# EAGLE schematic rt1060r1 (EAGLE 9.6.2)
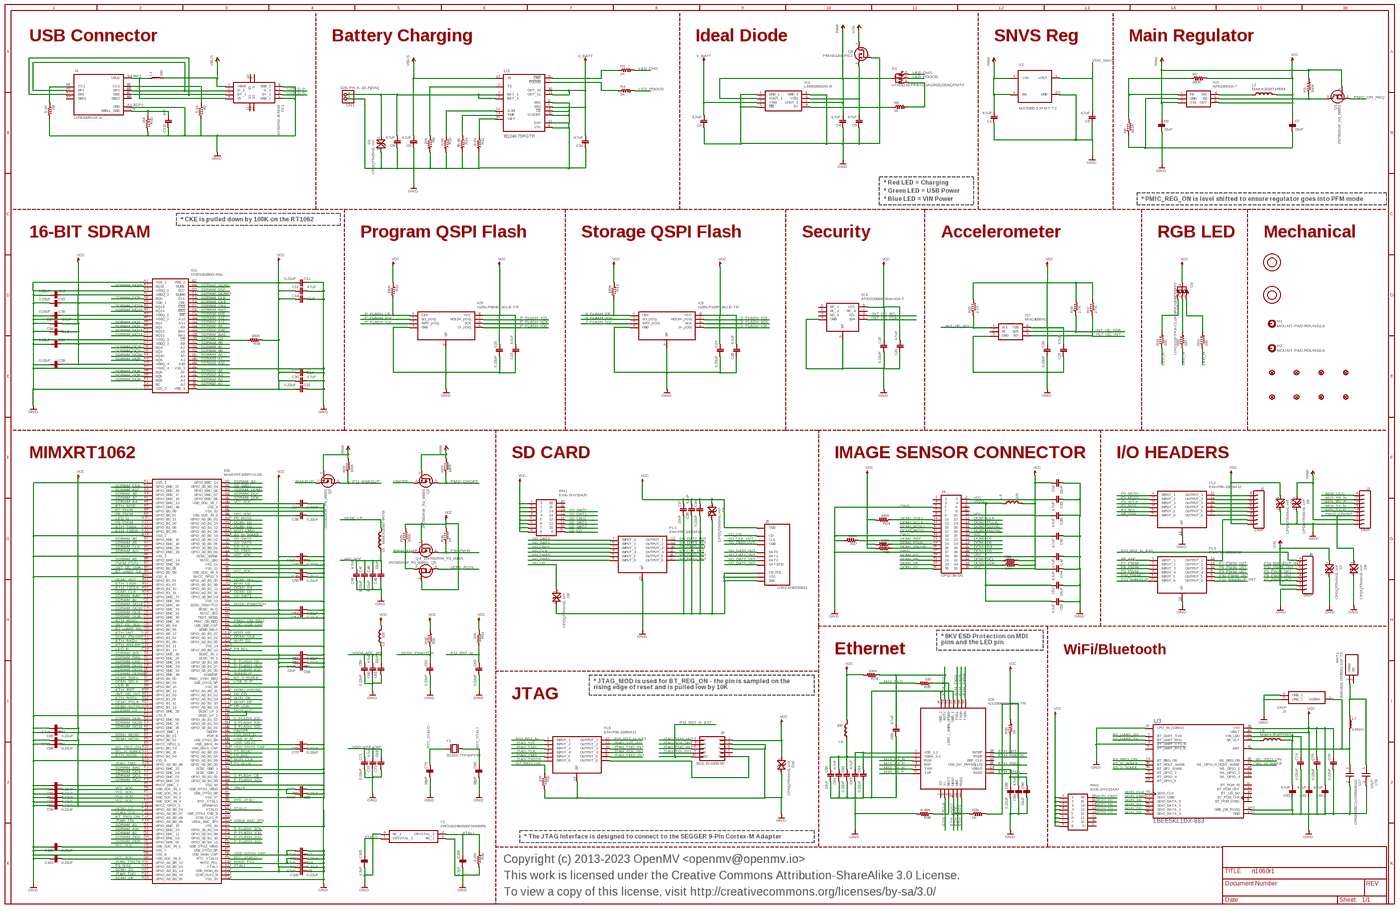
[diagram p0: schematic, sheet 1, overview]
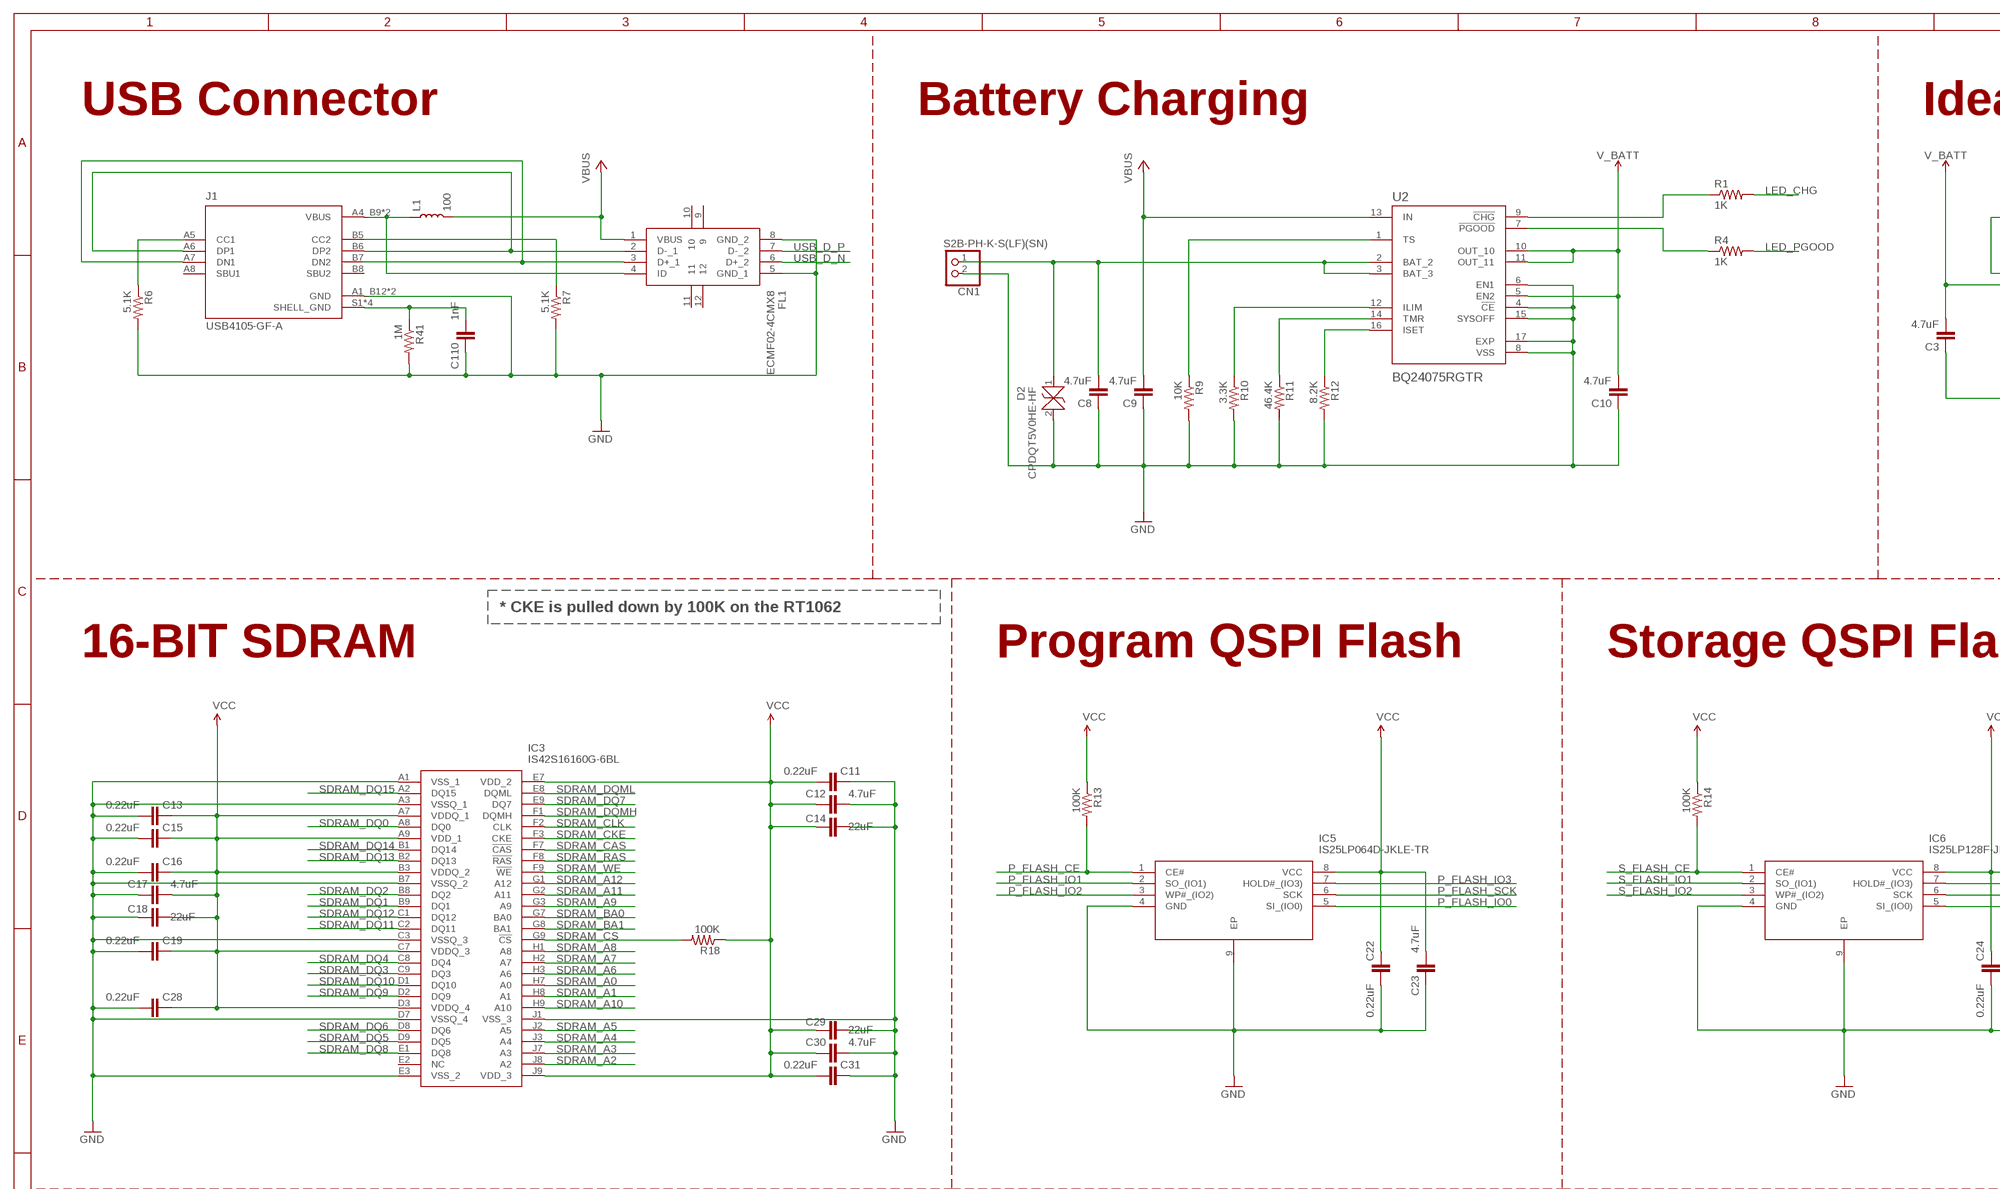
[diagram p1: schematic, sheet 1, part 1 of 4]
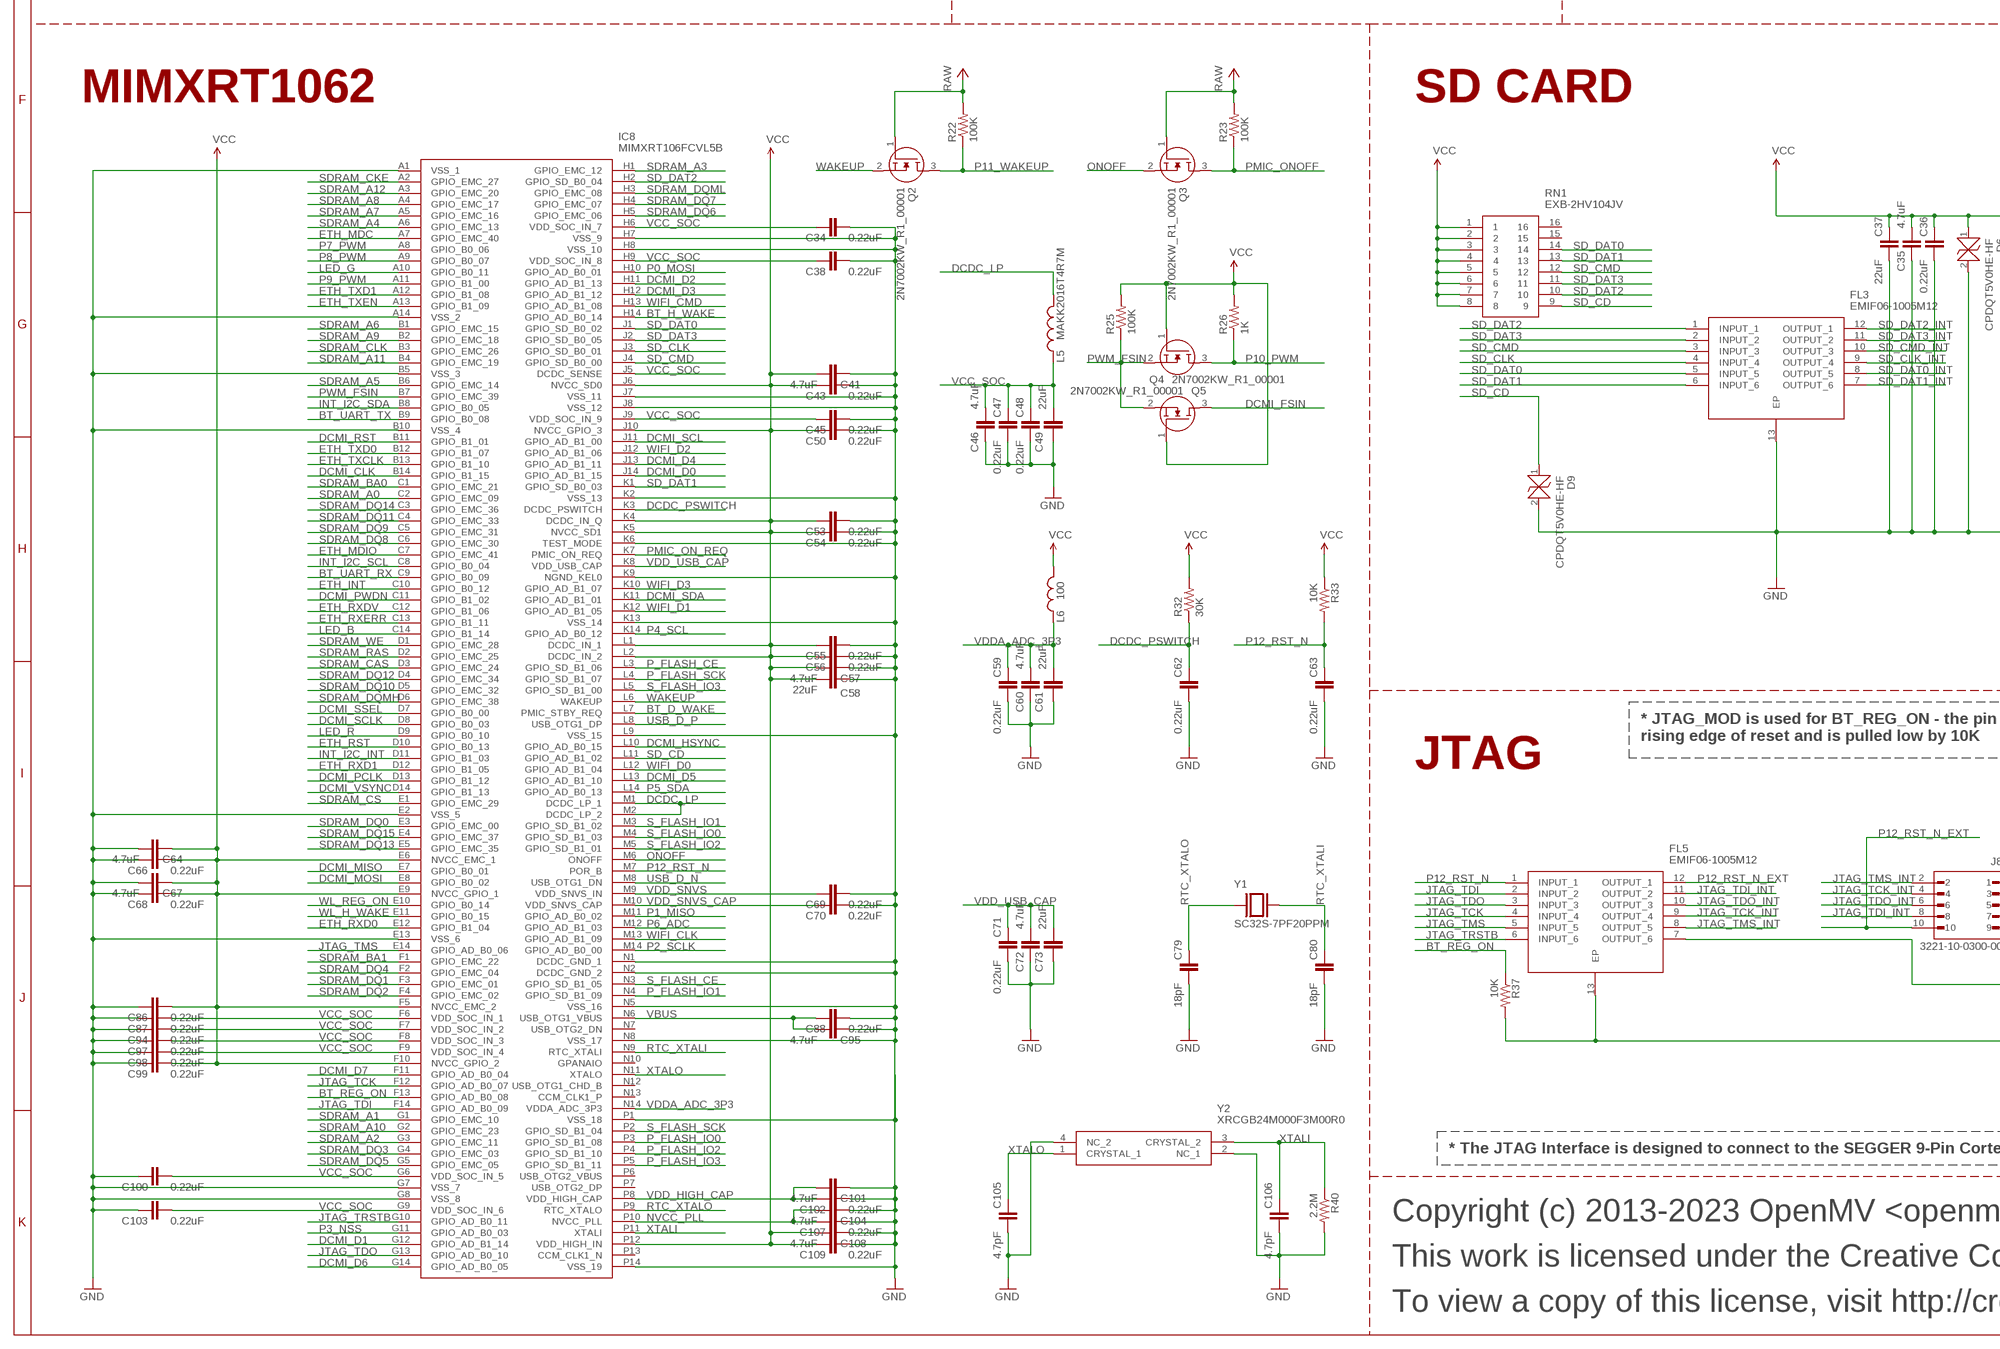
[diagram p2: schematic, sheet 1, part 2 of 4]
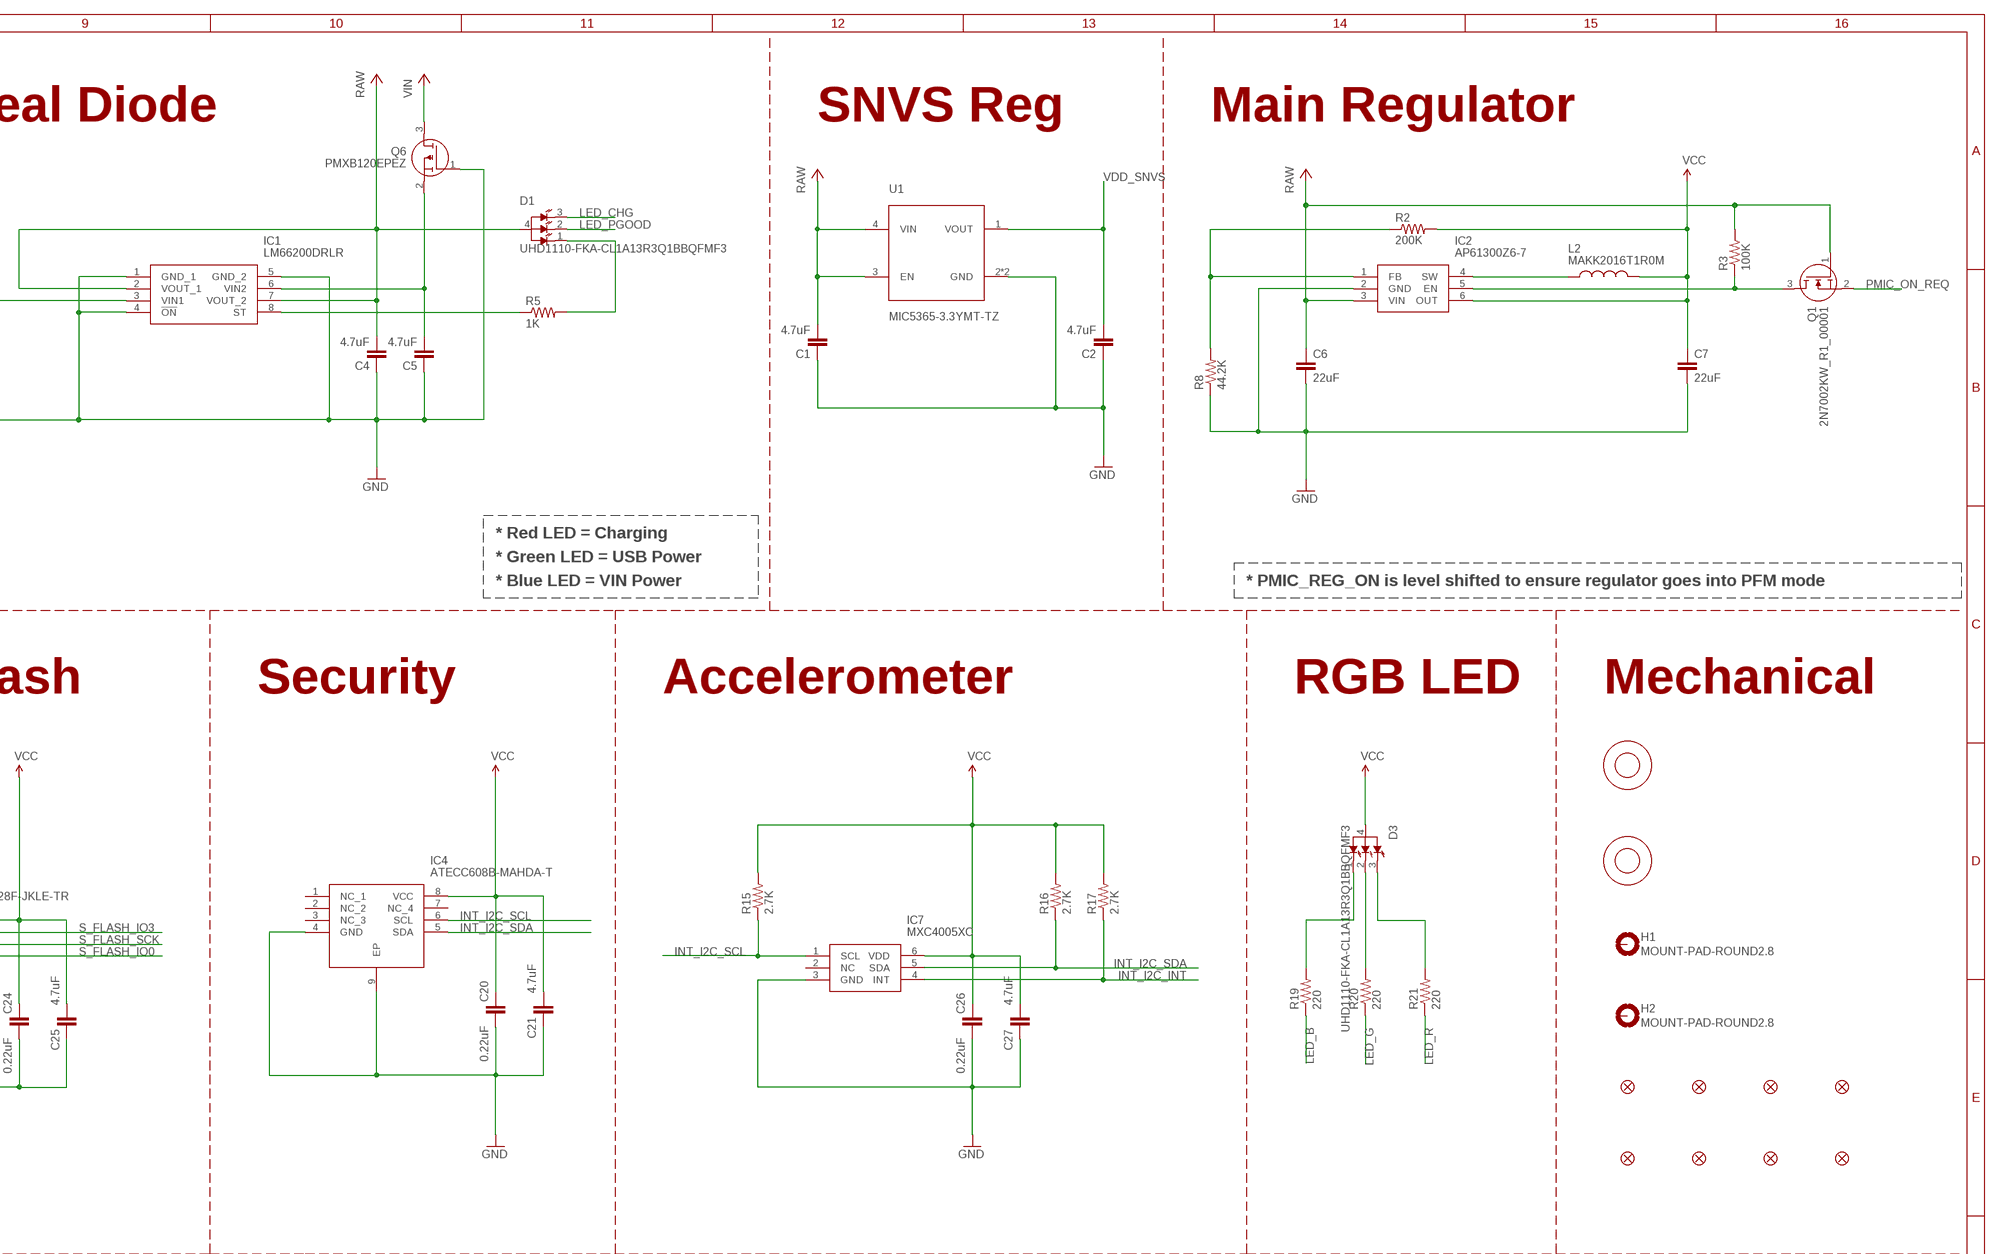
[diagram p3: schematic, sheet 1, part 3 of 4]
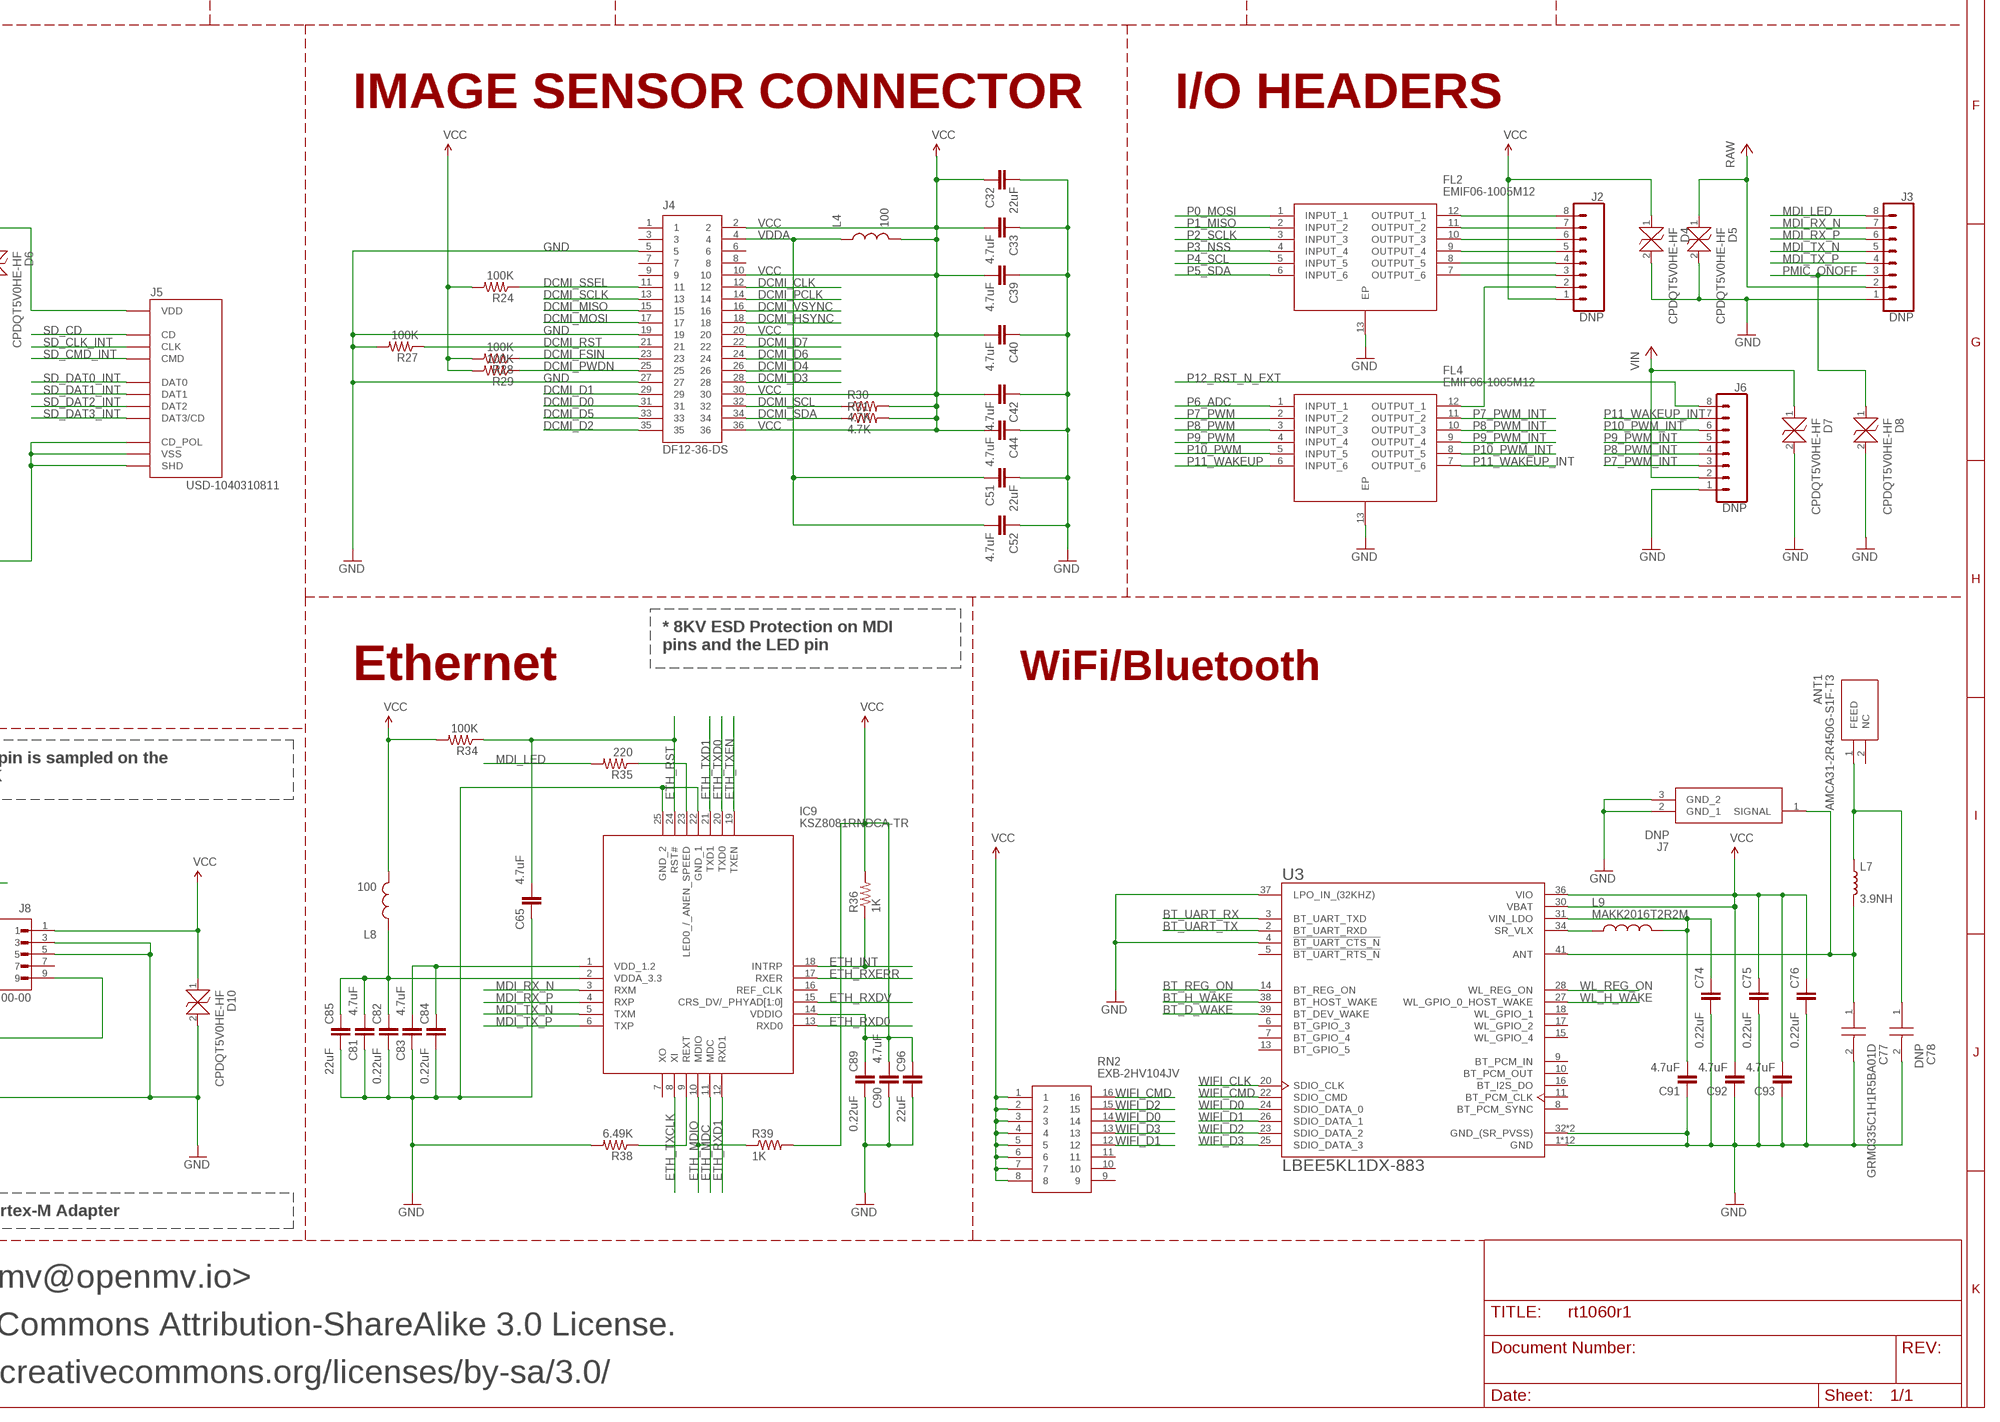
[diagram p4: schematic, sheet 1, part 4 of 4]

## Parts
ANT1  AMCA31-2R450G-S1F-T3  [ANTC3216X140N]
C1  4.7uF  CAP0402-CAP  [0402-CAP]
C2  4.7uF  CAP0402-CAP  [0402-CAP]
C3  4.7uF  CAP0402-CAP  [0402-CAP]
C4  4.7uF  CAP0402-CAP  [0402-CAP]
C5  4.7uF  CAP0402-CAP  [0402-CAP]
C6  22uF  22UF-0805-6.3V-20%  [0805]
C7  22uF  22UF-0805-6.3V-20%  [0805]
C8  4.7uF  CAP0402-CAP  [0402-CAP]
C9  4.7uF  CAP0402-CAP  [0402-CAP]
C10  4.7uF  CAP0402-CAP  [0402-CAP]
C11  0.22uF  C-EUC0201  [C0201]
C12  4.7uF  CAP0402-CAP  [0402-CAP]
C13  0.22uF  C-EUC0201  [C0201]
C14  22uF  22UF-0805-6.3V-20%  [0805]
C15  0.22uF  C-EUC0201  [C0201]
C16  0.22uF  C-EUC0201  [C0201]
C17  4.7uF  CAP0402-CAP  [0402-CAP]
C18  22uF  22UF-0805-6.3V-20%  [0805]
C19  0.22uF  C-EUC0201  [C0201]
C20  0.22uF  C-EUC0201  [C0201]
C21  4.7uF  CAP0402-CAP  [0402-CAP]
C22  0.22uF  C-EUC0201  [C0201]
C23  4.7uF  CAP0402-CAP  [0402-CAP]
C24  0.22uF  C-EUC0201  [C0201]
C25  4.7uF  CAP0402-CAP  [0402-CAP]
C26  0.22uF  C-EUC0201  [C0201]
C27  4.7uF  CAP0402-CAP  [0402-CAP]
C28  0.22uF  C-EUC0201  [C0201]
C29  22uF  22UF-0805-6.3V-20%  [0805]
C30  4.7uF  CAP0402-CAP  [0402-CAP]
C31  0.22uF  C-EUC0201  [C0201]
C32  22uF  22UF-0805-6.3V-20%  [0805]
C33  4.7uF  CAP0402-CAP  [0402-CAP]
C34  0.22uF  C-EUC0201  [C0201]
C35  4.7uF  CAP0402-CAP  [0402-CAP]
C36  0.22uF  C-EUC0201  [C0201]
C37  22uF  22UF-0805-6.3V-20%  [0805]
C38  0.22uF  C-EUC0201  [C0201]
C39  4.7uF  CAP0402-CAP  [0402-CAP]
C40  4.7uF  CAP0402-CAP  [0402-CAP]
C41  4.7uF  CAP0402-CAP  [0402-CAP]
C42  4.7uF  CAP0402-CAP  [0402-CAP]
C43  0.22uF  C-EUC0201  [C0201]
C44  4.7uF  CAP0402-CAP  [0402-CAP]
C45  0.22uF  C-EUC0201  [C0201]
C46  4.7uF  CAP0402-CAP  [0402-CAP]
C47  0.22uF  C-EUC0201  [C0201]
C48  0.22uF  C-EUC0201  [C0201]
C49  22uF  22UF-0805-6.3V-20%  [0805]
C50  0.22uF  C-EUC0201  [C0201]
C51  22uF  22UF-0805-6.3V-20%  [0805]
C52  4.7uF  CAP0402-CAP  [0402-CAP]
C53  0.22uF  C-EUC0201  [C0201]
C54  0.22uF  C-EUC0201  [C0201]
C55  0.22uF  C-EUC0201  [C0201]
C56  0.22uF  C-EUC0201  [C0201]
C57  4.7uF  CAP0402-CAP  [0402-CAP]
C58  22uF  22UF-0805-6.3V-20%  [0805]
C59  0.22uF  C-EUC0201  [C0201]
C60  4.7uF  CAP0402-CAP  [0402-CAP]
C61  22uF  22UF-0805-6.3V-20%  [0805]
C62  0.22uF  C-EUC0201  [C0201]
C63  0.22uF  C-EUC0201  [C0201]
C64  4.7uF  CAP0402-CAP  [0402-CAP]
C65  4.7uF  CAP0402-CAP  [0402-CAP]
C66  0.22uF  C-EUC0201  [C0201]
C67  4.7uF  CAP0402-CAP  [0402-CAP]
C68  0.22uF  C-EUC0201  [C0201]
C69  0.22uF  C-EUC0201  [C0201]
C70  0.22uF  C-EUC0201  [C0201]
C71  0.22uF  C-EUC0201  [C0201]
C72  4.7uF  CAP0402-CAP  [0402-CAP]
C73  22uF  22UF-0805-6.3V-20%  [0805]
C74  0.22uF  C-EUC0201  [C0201]
C75  0.22uF  C-EUC0201  [C0201]
C76  0.22uF  C-EUC0201  [C0201]
C77  GRM0335C1H1R5BA01D  [CAPC0603X33N]
C78  DNP  GRM0335C1H1R5BA01D  [CAPC0603X33N]
C79  18pF  C-EUC0201  [C0201]
C80  18pF  C-EUC0201  [C0201]
C81  4.7uF  CAP0402-CAP  [0402-CAP]
C82  0.22uF  C-EUC0201  [C0201]
C83  4.7uF  CAP0402-CAP  [0402-CAP]
C84  0.22uF  C-EUC0201  [C0201]
C85  22uF  22UF-0805-6.3V-20%  [0805]
C86  0.22uF  C-EUC0201  [C0201]
C87  0.22uF  C-EUC0201  [C0201]
C88  0.22uF  C-EUC0201  [C0201]
C89  0.22uF  C-EUC0201  [C0201]
C90  4.7uF  CAP0402-CAP  [0402-CAP]
C91  4.7uF  CAP0402-CAP  [0402-CAP]
C92  4.7uF  CAP0402-CAP  [0402-CAP]
C93  4.7uF  CAP0402-CAP  [0402-CAP]
C94  0.22uF  C-EUC0201  [C0201]
C95  4.7uF  CAP0402-CAP  [0402-CAP]
C96  22uF  22UF-0805-6.3V-20%  [0805]
C97  0.22uF  C-EUC0201  [C0201]
C98  0.22uF  C-EUC0201  [C0201]
C99  0.22uF  C-EUC0201  [C0201]
C100  0.22uF  C-EUC0201  [C0201]
C101  4.7uF  CAP0402-CAP  [0402-CAP]
C102  0.22uF  C-EUC0201  [C0201]
C103  0.22uF  C-EUC0201  [C0201]
C104  4.7uF  CAP0402-CAP  [0402-CAP]
C105  4.7pF  C-EUC0201  [C0201]
C106  4.7pF  C-EUC0201  [C0201]
C107  0.22uF  C-EUC0201  [C0201]
C108  4.7uF  CAP0402-CAP  [0402-CAP]
C109  0.22uF  C-EUC0201  [C0201]
C110  1nF  CAP0402-CAP  [0402-CAP]
CN1  S2B-PH-K-S(LF)(SN)  JST_2PIN-THM-RA  [JST-PH-2-THM-RA]
D1  UHD1110-FKA-CL1A13R3Q1BBQFMF3  [LED_UHD1110-FKA-CL1A13R3Q1BBQFMF3]
D2  CPDQT5V0HE-HF  [CPDQT5V0HEHF]
D3  UHD1110-FKA-CL1A13R3Q1BBQFMF3  [LED_UHD1110-FKA-CL1A13R3Q1BBQFMF3]
D4  CPDQT5V0HE-HF  [CPDQT5V0HEHF]
D5  CPDQT5V0HE-HF  [CPDQT5V0HEHF]
D6  CPDQT5V0HE-HF  [CPDQT5V0HEHF]
D7  CPDQT5V0HE-HF  [CPDQT5V0HEHF]
D8  CPDQT5V0HE-HF  [CPDQT5V0HEHF]
D9  CPDQT5V0HE-HF  [CPDQT5V0HEHF]
D10  CPDQT5V0HE-HF  [CPDQT5V0HEHF]
FD1  FIDUCIAL1X2  [FIDUCIAL-1X2]
FD2  FIDUCIAL1X2  [FIDUCIAL-1X2]
FD3  FIDUCIAL1X2  [FIDUCIAL-1X2]
FD4  FIDUCIAL1X2  [FIDUCIAL-1X2]
FD5  FIDUCIAL1X2  [FIDUCIAL-1X2]
FD6  FIDUCIAL1X2  [FIDUCIAL-1X2]
FD7  FIDUCIAL1X2  [FIDUCIAL-1X2]
FD8  FIDUCIAL1X2  [FIDUCIAL-1X2]
FL1  ECMF02-4CMX8  [ECMF024CMX8]
FL2  EMIF06-1005M12  [SON40P150X250X65-13N]
FL3  EMIF06-1005M12  [SON40P150X250X65-13N]
FL4  EMIF06-1005M12  [SON40P150X250X65-13N]
FL5  EMIF06-1005M12  [SON40P150X250X65-13N]
H1  MOUNT-PAD-ROUND2.8  [2,8-PAD]
H2  MOUNT-PAD-ROUND2.8  [2,8-PAD]
IC1  LM66200DRLR  [SOTFL50P160X60-8N]
IC2  AP61300Z6-7  [SOTFL50P162X60-6N]
IC3  IS42S16160G-6BL  [BGA54C80P9X9_800X800X120]
IC4  ATECC608B-MAHDA-T  [SON50P300X200X60-9N]
IC5  IS25LP064D-JKLE-TR  [SON127P500X595X80-9N]
IC6  IS25LP128F-JKLE-TR  [SON127P500X595X80-9N]
IC7  MXC4005XC  [MXC4005XC]
IC8  MIMXRT106FCVL5B  MIMXRT1052DVL6B  [BGA196C65P14X14_1000X1000X143]
IC9  KSZ8081RNDCA-TR  [QFN50P400X400X90-25N]
J1  USB4105-GF-A  [GCT_USB4105-GF-A]
J2  DNP  CONN_08"  [1X08]
J3  DNP  CONN_08"  [1X08]
J4  DF12-36-DS  [DF12-36-DS]
J5  USD-1040310811  [1040310811]
J6  DNP  CONN_08"  [1X08]
J7  DNP  2337019-1  [23370191]
J8  3221-10-0300-00  [CNC_3221-10-0300-00]
L1  100  INDUCTOR-0603-33NH  [0603]
L2  MAKK2016T1R0M  [INDC2016X100N]
L4  100  INDUCTOR0402  [C0402]
L5  MAKK2016T4R7M  [INDC2016X100N]
L6  100  INDUCTOR0402  [C0402]
L7  3.9NH  INDUCTOR-0402-3.9NH  [0402]
L8  100  INDUCTOR0402  [C0402]
L9  MAKK2016T2R2M  [INDC2016X100N]
M1  9774030151R  [9774030151R]
M2  9774030151R  [9774030151R]
Q1  2N7002KW_R1_00001  [SOT65P210X110-3N]
Q2  2N7002KW_R1_00001  [SOT65P210X110-3N]
Q3  2N7002KW_R1_00001  [SOT65P210X110-3N]
Q4  2N7002KW_R1_00001  [SOT65P210X110-3N]
Q5  2N7002KW_R1_00001  [SOT65P210X110-3N]
Q6  PMXB120EPEZ  [PMXB120EPEZ]
R1  1K  RESISTOR0402-RES  [0402-RES]
R2  200K  RESISTOR0402-RES  [0402-RES]
R3  100K  RESISTOR0402-RES  [0402-RES]
R4  1K  RESISTOR0402-RES  [0402-RES]
R5  1K  RESISTOR0402-RES  [0402-RES]
R6  5.1K  RESISTOR0402-RES  [0402-RES]
R7  5.1K  RESISTOR0402-RES  [0402-RES]
R8  44.2K  RESISTOR0402-RES  [0402-RES]
R9  10K  RESISTOR0402-RES  [0402-RES]
R10  3.3K  RESISTOR0402-RES  [0402-RES]
R11  46.4K  RESISTOR0402-RES  [0402-RES]
R12  8.2K  RESISTOR0402-RES  [0402-RES]
R13  100K  RESISTOR0402-RES  [0402-RES]
R14  100K  RESISTOR0402-RES  [0402-RES]
R15  2.7K  RESISTOR0402-RES  [0402-RES]
R16  2.7K  RESISTOR0402-RES  [0402-RES]
R17  2.7K  RESISTOR0402-RES  [0402-RES]
R18  100K  RESISTOR0402-RES  [0402-RES]
R19  220  RESISTOR0402-RES  [0402-RES]
R20  220  RESISTOR0402-RES  [0402-RES]
R21  220  RESISTOR0402-RES  [0402-RES]
R22  100K  RESISTOR0402-RES  [0402-RES]
R23  100K  RESISTOR0402-RES  [0402-RES]
R24  100K  RESISTOR0402-RES  [0402-RES]
R25  100K  RESISTOR0402-RES  [0402-RES]
R26  1K  RESISTOR0402-RES  [0402-RES]
R27  100K  RESISTOR0402-RES  [0402-RES]
R28  100K  RESISTOR0402-RES  [0402-RES]
R29  100K  RESISTOR0402-RES  [0402-RES]
R30  4.7K  RESISTOR0402-RES  [0402-RES]
R31  4.7K  RESISTOR0402-RES  [0402-RES]
R32  30K  RESISTOR0402-RES  [0402-RES]
R33  10K  RESISTOR0402-RES  [0402-RES]
R34  100K  RESISTOR0402-RES  [0402-RES]
R35  220  RESISTOR0402-RES  [0402-RES]
R36  1K  RESISTOR0402-RES  [0402-RES]
R37  10K  RESISTOR0402-RES  [0402-RES]
R38  6.49K  RESISTOR0402-RES  [0402-RES]
R39  1K  RESISTOR0402-RES  [0402-RES]
R40  2.2M  RESISTOR0402-RES  [0402-RES]
R41  1M  RESISTOR0402-RES  [0402-RES]
RN1  EXB-2HV104JV  [EXB2HV104JV]
RN2  EXB-2HV104JV  [EXB2HV104JV]
U1  MIC5365-3.3YMT-TZ  [VREG_MIC5365-3.3YMT-TZ]
U2  BQ24075RGTR  [QFN50P300X300X100-17N]
U3  LBEE5KL1DX-883  LBEE5KL1DX-TEMP  [XCVR_LBEE5KL1DX-TEMP]
Y1  SC32S-7PF20PPM  ABS07-32.768KHZ-7-T  [XTAL_ABS07-32.768KHZ-7-T]
Y2  XRCGB24M000F3M00R0  [XRCGB24M000F3M00R0]

## Nets
ANT: C77.1 J7.1(SIGNAL) L7.2 U3.41(ANT)
BAT [power]: C8.2 CN1.1 D2.1 U2.2(BAT_2) U2.3(BAT_3)
BT_D_WAKE: IC8.L7(PMIC_STBY_REQ) U3.39(BT_DEV_WAKE)
BT_H_WAKE: IC8.H14(GPIO_AD_B0_14) U3.38(BT_HOST_WAKE)
BT_REG_ON: IC8.F13(GPIO_AD_B0_08) R37.1 U3.14(BT_REG_ON)
BT_UART_RX: IC8.C9(GPIO_B0_09) U3.3(BT_UART_TXD)
BT_UART_TX: IC8.B9(GPIO_B0_08) U3.2(BT_UART_RXD)
CC1: J1.A5(CC1) R6.1
CC2: J1.B5(CC2) R7.1
CHG: R1.1 U2.9(!CHG)
D_N [usb]: FL1.3(D+_1) J1.A7(DN1) J1.B7(DN2)
D_P [usb]: FL1.2(D-_1) J1.A6(DP1) J1.B6(DP2)
DCDC_LP: IC8.M1(DCDC_LP_1) IC8.M2(DCDC_LP_2) L5.2
DCDC_PSWITCH: C62.1 IC8.K3(DCDC_PSWITCH) R32.1
DCMI_CLK: IC8.B14(GPIO_B1_15) J4.12
DCMI_D0 [dcmi]: IC8.J14(GPIO_AD_B1_15) J4.31
DCMI_D1 [dcmi]: IC8.G12(GPIO_AD_B1_14) J4.29
DCMI_D2 [dcmi]: IC8.H11(GPIO_AD_B1_13) J4.35
DCMI_D3 [dcmi]: IC8.H12(GPIO_AD_B1_12) J4.28
DCMI_D4 [dcmi]: IC8.J13(GPIO_AD_B1_11) J4.26
DCMI_D5 [dcmi]: IC8.L13(GPIO_AD_B1_10) J4.33
DCMI_D6 [dcmi]: IC8.G14(GPIO_AD_B0_05) J4.24
DCMI_D7 [dcmi]: IC8.F11(GPIO_AD_B0_04) J4.22
DCMI_FSIN: J4.23 Q5.3(D) R28.1
DCMI_HSYNC [dcmi]: IC8.L10(GPIO_AD_B0_15) J4.18
DCMI_MISO [spi]: IC8.E7(GPIO_B0_01) J4.15
DCMI_MOSI [spi]: IC8.E8(GPIO_B0_02) J4.17
DCMI_PCLK [dcmi]: IC8.D13(GPIO_B1_12) J4.14
DCMI_PWDN: IC8.C11(GPIO_B1_02) J4.25 R29.1
DCMI_RST: IC8.B11(GPIO_B1_01) J4.21 R27.1
DCMI_SCL [i2c]: IC8.J11(GPIO_AD_B1_00) J4.32 R30.1
DCMI_SCLK [spi]: IC8.D8(GPIO_B0_03) J4.13
DCMI_SDA [i2c]: IC8.K11(GPIO_AD_B1_01) J4.34 R31.1
DCMI_SSEL [spi]: IC8.D7(GPIO_B0_00) J4.11 R24.1
DCMI_VSYNC [dcmi]: IC8.D14(GPIO_B1_13) J4.16
EN: IC2.5(EN) Q1.3(D) R3.1
ETH_INT: IC8.C10(GPIO_B0_12) IC9.18(INTRP) R36.1
ETH_LED: IC9.23(LED0_/_ANEN_SPEED) R35.1
ETH_MDC [mdio]: IC8.A7(GPIO_EMC_40) IC9.11(MDC)
ETH_MDIO [mdio]: IC8.C7(GPIO_EMC_41) IC9.10(MDIO) R39.1
ETH_RST: C65.2 IC8.D10(GPIO_B0_13) IC9.24(RST#) R34.1
ETH_RXD0 [eth]: IC8.E12(GPIO_B1_04) IC9.13(RXD0)
ETH_RXD1 [eth]: IC8.D12(GPIO_B1_05) IC9.12(RXD1)
ETH_RXDV [eth]: IC8.C12(GPIO_B1_06) IC9.15(CRS_DV/_PHYAD[1:0])
ETH_RXERR [eth]: IC8.C13(GPIO_B1_11) IC9.17(RXER)
ETH_TXCLK [eth]: IC8.B13(GPIO_B1_10) IC9.8(XI)
ETH_TXD0 [eth]: IC8.B12(GPIO_B1_07) IC9.20(TXD0)
ETH_TXD1 [eth]: IC8.A12(GPIO_B1_08) IC9.21(TXD1)
ETH_TXEN [eth]: IC8.A13(GPIO_B1_09) IC9.19(TXEN)
ETH_VDD_1.2: C83.2 C84.1 IC9.1(VDD_1.2)
ETH_VDDA_3.3: C81.2 C82.1 C85.1 IC9.2(VDDA_3.3) L8.1
FB [power]: IC2.1(FB) R2.1 R8.2
FEED: ANT1.1(FEED) C78.1 L7.1
GND [gnd]: C1.1 C2.1 C3.1 C4.1 C5.1 C6.2 C7.2 C8.1 C9.1 C10.1 C11.1 C12.2 C13.2 C14.2 C15.2 C16.2 C17.1 C18.1 C19.2 C20.2 C21.1 C22.2 C23.1 C24.2 C25.1 C26.2 C27.1 C28.2 C29.2 C30.2 C31.1 C32.2 C33.1 C34.2 C35.1 C36.2 C37.2 C38.2 C39.1 C40.1 C41.1 C42.1 C43.2 C44.1 C45.2 C46.1 C47.2 C48.2 C49.1 C50.2 C51.2 C52.1 C53.2 C54.2 C55.2 C56.2 C57.1 C58.1 C59.2 C60.1 C61.1 C62.2 C63.2 C64.2 C65.1 C66.1 C67.2 C68.1 C69.2 C70.2 C71.2 C72.1 C73.1 C74.2 C75.2 C76.2 C77.2 C78.2 C79.2 C80.2 C81.1 C82.2 C83.1 C84.2 C85.2 C86.1 C87.1 C88.2 C89.2 C90.1 C91.1 C92.1 C93.1 C94.1 C95.1 C96.2 C97.1 C98.1 C99.1 C100.1 C101.1 C102.2 C103.1 C104.1 C105.2 C106.2 C107.2 C108.1 C109.2 C110.1 CN1.2 D2.2 D4.2 D5.2 D6.2 D7.2 D8.2 D9.2 D10.2 FL1.5(GND_1) FL1.8(GND_2) FL2.13(EP) FL3.13(EP) FL4.13(EP) FL5.13(EP) IC1.1(GND_1) IC1.4(!ON) IC1.5(GND_2) IC2.2(GND) IC3.A1(VSS_1) IC3.A3(VSSQ_1) IC3.B7(VSSQ_2) IC3.C3(VSSQ_3) IC3.D7(VSSQ_4) IC3.E3(VSS_2) IC3.J1(VSS_3) IC4.4(GND) IC4.9(EP) IC5.4(GND) IC5.9(EP) IC6.4(GND) IC6.9(EP) IC7.3(GND) IC8.A1(VSS_1) IC8.A14(VSS_2) IC8.B5(VSS_3) IC8.B10(VSS_4) IC8.E2(VSS_5) IC8.E13(VSS_6) IC8.G7(VSS_7) IC8.G8(VSS_8) IC8.H7(VSS_9) IC8.H8(VSS_10) IC8.J7(VSS_11) IC8.J8(VSS_12) IC8.K2(VSS_13) IC8.K6(TEST_MODE) IC8.K9(NGND_KEL0) IC8.K13(VSS_14) IC8.L9(VSS_15) IC8.N1(DCDC_GND_1) IC8.N2(DCDC_GND_2) IC8.N5(VSS_16) IC8.N8(VSS_17) IC8.P1(VSS_18) IC8.P14(VSS_19) IC9.22(GND_1) IC9.25(GND_2) J1.A1_B12(GND) J1.B1_A12(GND) J3.1 J4.5 J4.19 J4.27 J5.CD$2(CD_POL) J5.G$1(SHD) J5.G$2(SHD) J5.G$3(SHD) J5.G$4(SHD) J5.P$6(VSS) J6.1 J7.2(GND_1) J7.3(GND_2) J8.3 J8.5 Q6.1(G) R6.2 R7.2 R8.1 R9.2 R10.2 R11.2 R12.2 R27.2 R37.2 R38.2 R40.2 R41.2 U1.2(GND) U1.EP(GND) U2.4(!CE) U2.6(EN1) U2.8(VSS) U2.15(SYSOFF) U2.17(EXP) U3.1(GND) U3.4(!BT_UART_CTS_N) U3.12(GND) U3.19(GND) U3.21(GND) U3.29(GND) U3.32(GND_(SR_PVSS)) U3.33(GND_(SR_PVSS)) U3.35(GND) U3.37(LPO_IN_(32KHZ)) U3.40(GND) U3.42(GND) U3.43(GND) U3.44(GND) U3.45(GND) U3.46(GND) Y2.2(NC_1) Y2.4(NC_2)
ILIM [power]: R10.1 U2.12(ILIM)
INT_I2C_INT: IC7.4(INT) IC8.D11(GPIO_B1_03) R17.1
INT_I2C_SCL [i2c]: IC4.6(SCL) IC7.1(SCL) IC8.C8(GPIO_B0_04) R15.1
INT_I2C_SDA [i2c]: IC4.5(SDA) IC7.5(SDA) IC8.B8(GPIO_B0_05) R16.1
ISET [power]: R12.1 U2.16(ISET)
JTAG_TCK [jtag]: FL5.4(INPUT_4) IC8.F12(GPIO_AD_B0_07)
JTAG_TCK_INT [jtag]: FL5.9(OUTPUT_4) J8.4
JTAG_TDI [jtag]: FL5.2(INPUT_2) IC8.F14(GPIO_AD_B0_09)
JTAG_TDI_INT [jtag]: FL5.11(OUTPUT_2) J8.8
JTAG_TDO [jtag]: FL5.3(INPUT_3) IC8.G13(GPIO_AD_B0_10)
JTAG_TDO_INT [jtag]: FL5.10(OUTPUT_3) J8.6
JTAG_TMS [jtag]: FL5.5(INPUT_5) IC8.E14(GPIO_AD_B0_06)
JTAG_TMS_INT [jtag]: FL5.8(OUTPUT_5) J8.2
JTAG_TRSTB [jtag]: FL5.6(INPUT_6) IC8.G10(GPIO_AD_B0_11)
JTAG_TRSTB_INT [jtag]: FL5.7(OUTPUT_6) J8.9
LED_B: IC8.C14(GPIO_B1_14) R19.1
LED_B_INT: D3.1(BLUE) R19.2
LED_CHG: D1.3(RED) R1.2
LED_G: IC8.A10(GPIO_B0_11) R20.1
LED_G_INT: D3.2(GREEN) R20.2
LED_PGOOD: D1.2(GREEN) R4.2
LED_R: IC8.D9(GPIO_B0_10) R21.1
LED_R_INT: D3.3(RED) R21.2
LED_ST: D1.1(BLUE) R5.2
MDI_LED: J3.8 R35.2
MDI_RX_N [mdi]: IC9.3(RXM) J3.7
MDI_RX_P [mdi]: IC9.4(RXP) J3.6
MDI_TX_N [mdi]: IC9.5(TXM) J3.5
MDI_TX_P [mdi]: IC9.6(TXP) J3.4
NVCC_PLL: C104.2 C107.1 IC8.P10(NVCC_PLL)
ONOFF: IC8.M6(ONOFF) Q3.2(S)
P0_MOSI [spi]: FL2.1(INPUT_1) IC8.H10(GPIO_AD_B0_01)
P0_MOSI_INT [spi]: FL2.12(OUTPUT_1) J2.8
P1_MISO [spi]: FL2.2(INPUT_2) IC8.M11(GPIO_AD_B0_02)
P1_MISO_INT [spi]: FL2.11(OUTPUT_2) J2.7
P2_SCLK [spi]: FL2.3(INPUT_3) IC8.M14(GPIO_AD_B0_00)
P2_SCLK_INT [spi]: FL2.10(OUTPUT_3) J2.6
P3_NSS [spi]: FL2.4(INPUT_4) IC8.G11(GPIO_AD_B0_03)
P3_NSS_INT [spi]: FL2.9(OUTPUT_4) J2.5
P4_SCL [i2c]: FL2.5(INPUT_5) IC8.K14(GPIO_AD_B0_12)
P4_SCL_INT [i2c]: FL2.8(OUTPUT_5) J2.4
P5_SDA [i2c]: FL2.6(INPUT_6) IC8.L14(GPIO_AD_B0_13)
P5_SDA_INT [i2c]: FL2.7(OUTPUT_6) J2.3
P6_ADC: FL4.1(INPUT_1) IC8.M12(GPIO_AD_B1_03)
P6_ADC_INT: FL4.12(OUTPUT_1) J2.2
P7_PWM: FL4.2(INPUT_2) IC8.A8(GPIO_B0_06)
P7_PWM_INT: FL4.11(OUTPUT_2) J6.3
P8_PWM: FL4.3(INPUT_3) IC8.A9(GPIO_B0_07)
P8_PWM_INT: FL4.10(OUTPUT_3) J6.4
P9_PWM: FL4.4(INPUT_4) IC8.A11(GPIO_B1_00)
P9_PWM_INT: FL4.9(OUTPUT_4) J6.5
P10_PWM: FL4.5(INPUT_5) Q4.3(D) R26.1
P10_PWM_INT: FL4.8(OUTPUT_5) J6.6
P11_WAKEUP: FL4.6(INPUT_6) Q2.3(D) R22.1
P11_WAKEUP_INT: FL4.7(OUTPUT_6) J6.7
P12_RST_N: C63.1 FL5.1(INPUT_1) IC8.M7(POR_B) R33.2
P12_RST_N_EXT: FL5.12(OUTPUT_1) J6.8 J8.10
P_FLASH_CE [flash]: IC5.1(CE#) IC8.L3(GPIO_SD_B1_06) R13.2
P_FLASH_IO0 [flash]: IC5.5(SI_(IO0)) IC8.P3(GPIO_SD_B1_08)
P_FLASH_IO1 [flash]: IC5.2(SO_(IO1)) IC8.N4(GPIO_SD_B1_09)
P_FLASH_IO2 [flash]: IC5.3(WP#_(IO2)) IC8.P4(GPIO_SD_B1_10)
P_FLASH_IO3 [flash]: IC5.7(HOLD#_(IO3)) IC8.P5(GPIO_SD_B1_11)
P_FLASH_SCK [flash]: IC5.6(SCK) IC8.L4(GPIO_SD_B1_07)
PGOOD: R4.1 U2.7(!PGOOD)
PMIC_ON_REQ: IC8.K7(PMIC_ON_REQ) Q1.2(S)
PMIC_ONOFF: D8.1 J3.3 Q3.3(D) R23.1
PWM_FSIN: IC8.B7(GPIO_EMC_39) Q4.2(S) Q5.2(S) R25.1
RAW: C1.2 C4.2 C6.1 D1.4(ANODE) D5.1 IC1.2(VOUT_1) IC1.7(VOUT_2) IC2.3(VIN) J3.2 Q1.1(G) Q2.1(G) Q3.1(G) R3.2 R22.2 R23.2 U1.3(EN) U1.4(VIN)
REXT: IC9.9(REXT) R38.1
RTC_XTALI: C80.1 IC8.N9(RTC_XTALI) Y1.2
RTC_XTALO: C79.1 IC8.P9(RTC_XTALO) Y1.1
S_FLASH_CE [flash]: IC6.1(CE#) IC8.N3(GPIO_SD_B1_05) R14.2
S_FLASH_IO0 [flash]: IC6.5(SI_(IO0)) IC8.M4(GPIO_SD_B1_03)
S_FLASH_IO1 [flash]: IC6.2(SO_(IO1)) IC8.M3(GPIO_SD_B1_02)
S_FLASH_IO2 [flash]: IC6.3(WP#_(IO2)) IC8.M5(GPIO_SD_B1_01)
S_FLASH_IO3 [flash]: IC6.7(HOLD#_(IO3)) IC8.L5(GPIO_SD_B1_00)
S_FLASH_SCK [flash]: IC6.6(SCK) IC8.P2(GPIO_SD_B1_04)
SD_CD: D9.1 IC8.L11(GPIO_AD_B1_02) J5.CD$1(CD) RN1.9
SD_CLK [sdcard]: FL3.4(INPUT_4) IC8.J3(GPIO_SD_B0_01)
SD_CLK_INT [sdcard]: FL3.9(OUTPUT_4) J5.P$5(CLK)
SD_CMD [sdcard]: FL3.3(INPUT_3) IC8.J4(GPIO_SD_B0_00) RN1.12
SD_CMD_INT [sdcard]: FL3.10(OUTPUT_3) J5.P$3(CMD)
SD_DAT0 [sdcard]: FL3.5(INPUT_5) IC8.J1(GPIO_SD_B0_02) RN1.14
SD_DAT0_INT: FL3.8(OUTPUT_5) J5.P$7(DAT0)
SD_DAT1 [sdcard]: FL3.6(INPUT_6) IC8.K1(GPIO_SD_B0_03) RN1.13
SD_DAT1_INT: FL3.7(OUTPUT_6) J5.P$8(DAT1)
SD_DAT2 [sdcard]: FL3.1(INPUT_1) IC8.H2(GPIO_SD_B0_04) RN1.10
SD_DAT2_INT [sdcard]: FL3.12(OUTPUT_1) J5.P$1(DAT2)
SD_DAT3 [sdcard]: FL3.2(INPUT_2) IC8.J2(GPIO_SD_B0_05) RN1.11
SD_DAT3_INT [sdcard]: FL3.11(OUTPUT_2) J5.P$2(DAT3/CD)
SDRAM_A0 [sdram]: IC3.H7(A0) IC8.C2(GPIO_EMC_09)
SDRAM_A1 [sdram]: IC3.H8(A1) IC8.G1(GPIO_EMC_10)
SDRAM_A2 [sdram]: IC3.J8(A2) IC8.G3(GPIO_EMC_11)
SDRAM_A3 [sdram]: IC3.J7(A3) IC8.H1(GPIO_EMC_12)
SDRAM_A4 [sdram]: IC3.J3(A4) IC8.A6(GPIO_EMC_13)
SDRAM_A5 [sdram]: IC3.J2(A5) IC8.B6(GPIO_EMC_14)
SDRAM_A6 [sdram]: IC3.H3(A6) IC8.B1(GPIO_EMC_15)
SDRAM_A7 [sdram]: IC3.H2(A7) IC8.A5(GPIO_EMC_16)
SDRAM_A8 [sdram]: IC3.H1(A8) IC8.A4(GPIO_EMC_17)
SDRAM_A9 [sdram]: IC3.G3(A9) IC8.B2(GPIO_EMC_18)
SDRAM_A10 [sdram]: IC3.H9(A10) IC8.G2(GPIO_EMC_23)
SDRAM_A11 [sdram]: IC3.G2(A11) IC8.B4(GPIO_EMC_19)
SDRAM_A12 [sdram]: IC3.G1(A12) IC8.A3(GPIO_EMC_20)
SDRAM_BA0 [sdram]: IC3.G7(BA0) IC8.C1(GPIO_EMC_21)
SDRAM_BA1 [sdram]: IC3.G8(BA1) IC8.F1(GPIO_EMC_22)
SDRAM_CAS [sdram]: IC3.F7(!CAS) IC8.D3(GPIO_EMC_24)
SDRAM_CKE [sdram]: IC3.F3(CKE) IC8.A2(GPIO_EMC_27)
SDRAM_CLK [sdram]: IC3.F2(CLK) IC8.B3(GPIO_EMC_26)
SDRAM_CS [sdram]: IC3.G9(!CS) IC8.E1(GPIO_EMC_29) R18.2
SDRAM_DQ0 [sdram]: IC3.A8(DQ0) IC8.E3(GPIO_EMC_00)
SDRAM_DQ1 [sdram]: IC3.B9(DQ1) IC8.F3(GPIO_EMC_01)
SDRAM_DQ2 [sdram]: IC3.B8(DQ2) IC8.F4(GPIO_EMC_02)
SDRAM_DQ3 [sdram]: IC3.C9(DQ3) IC8.G4(GPIO_EMC_03)
SDRAM_DQ4 [sdram]: IC3.C8(DQ4) IC8.F2(GPIO_EMC_04)
SDRAM_DQ5 [sdram]: IC3.D9(DQ5) IC8.G5(GPIO_EMC_05)
SDRAM_DQ6 [sdram]: IC3.D8(DQ6) IC8.H5(GPIO_EMC_06)
SDRAM_DQ7 [sdram]: IC3.E9(DQ7) IC8.H4(GPIO_EMC_07)
SDRAM_DQ8 [sdram]: IC3.E1(DQ8) IC8.C6(GPIO_EMC_30)
SDRAM_DQ9 [sdram]: IC3.D2(DQ9) IC8.C5(GPIO_EMC_31)
SDRAM_DQ10 [sdram]: IC3.D1(DQ10) IC8.D5(GPIO_EMC_32)
SDRAM_DQ11 [sdram]: IC3.C2(DQ11) IC8.C4(GPIO_EMC_33)
SDRAM_DQ12 [sdram]: IC3.C1(DQ12) IC8.D4(GPIO_EMC_34)
SDRAM_DQ13 [sdram]: IC3.B2(DQ13) IC8.E5(GPIO_EMC_35)
SDRAM_DQ14 [sdram]: IC3.B1(DQ14) IC8.C3(GPIO_EMC_36)
SDRAM_DQ15 [sdram]: IC3.A2(DQ15) IC8.E4(GPIO_EMC_37)
SDRAM_DQMH [sdram]: IC3.F1(DQMH) IC8.D6(GPIO_EMC_38)
SDRAM_DQML [sdram]: IC3.E8(DQML) IC8.H3(GPIO_EMC_08)
SDRAM_RAS [sdram]: IC3.F8(!RAS) IC8.D2(GPIO_EMC_25)
SDRAM_WE [sdram]: IC3.F9(!WE) IC8.D1(GPIO_EMC_28)
SHELL_GND [power]: C110.2 J1.S1(SHELL_GND) J1.S2(SHELL_GND) J1.S3(SHELL_GND) J1.S4(SHELL_GND) R41.1
SR_VLX: L9.1 U3.34(SR_VLX)
ST: IC1.8(ST) R5.1
SW [power]: IC2.4(SW) L2.1
TMR [power]: R11.1 U2.14(TMR)
TS [power]: R9.1 U2.1(TS)
USB_D_N [usb]: FL1.6(D+_2) IC8.M8(USB_OTG1_DN)
USB_D_P [usb]: FL1.7(D-_2) IC8.L8(USB_OTG1_DP)
USB_VBUS: FL1.4(ID) J1.A4_B9(VBUS) J1.B4_A9(VBUS) L1.1
V_BATT [power]: C3.2 C10.2 IC1.3(VIN1) U2.5(EN2) U2.10(OUT_10) U2.11(OUT_11)
VBUS: C9.2 C88.1 C95.2 FL1.1(VBUS) IC8.N6(USB_OTG1_VBUS) L1.2 U2.13(IN)
VCC: C7.1 C11.2 C12.1 C13.1 C14.1 C15.1 C16.1 C17.2 C18.2 C19.1 C20.1 C21.2 C22.1 C23.2 C24.1 C25.2 C26.1 C27.2 C28.1 C29.1 C30.1 C31.2 C32.1 C33.2 C35.2 C36.1 C37.1 C39.2 C40.2 C41.2 C42.2 C43.1 C44.2 C50.1 C53.1 C54.1 C55.1 C56.1 C57.2 C58.2 C64.1 C66.2 C67.1 C68.2 C75.1 C76.1 C86.2 C89.1 C90.2 C92.2 C93.2 C96.1 C99.2 C108.2 C109.1 D3.4(ANODE) D4.1 D6.1 D10.1 IC2.6(OUT) IC3.A7(VDDQ_1) IC3.A9(VDD_1) IC3.B3(VDDQ_2) IC3.C7(VDDQ_3) IC3.D3(VDDQ_4) IC3.E7(VDD_2) IC3.J9(VDD_3) IC4.8(VCC) IC5.8(VCC) IC6.8(VCC) IC7.6(VDD) IC8.E6(NVCC_EMC_1) IC8.E9(NVCC_GPIO_1) IC8.F5(NVCC_EMC_2) IC8.F10(NVCC_GPIO_2) IC8.J6(NVCC_SD0) IC8.J10(NVCC_GPIO_3) IC8.K4(DCDC_IN_Q) IC8.K5(NVCC_SD1) IC8.L1(DCDC_IN_1) IC8.L2(DCDC_IN_2) IC8.P12(VDD_HIGH_IN) IC9.14(VDDIO) J2.1 J4.2 J4.10 J4.20 J4.30 J4.36 J5.P$4(VDD) J8.1 L2.2 L4.2 L6.2 L8.2 Q4.1(G) Q5.1(G) R2.2 R13.1 R14.1 R15.2 R16.2 R17.2 R18.1 R24.2 R25.2 R26.2 R28.2 R29.2 R30.2 R31.2 R32.2 R33.1 R34.2 R36.2 R39.2 RN1.1 RN1.2 RN1.3 RN1.4 RN1.5 RN1.6 RN1.7 RN1.8 RN2.1 RN2.2 RN2.3 RN2.4 RN2.5 RN2.6 RN2.7 RN2.8 U3.30(VBAT) U3.36(VIO)
VCC_SOC: C34.1 C38.1 C45.1 C46.2 C47.1 C48.1 C49.2 C87.2 C94.2 C97.2 C98.2 C100.2 C103.2 IC8.F6(VDD_SOC_IN_1) IC8.F7(VDD_SOC_IN_2) IC8.F8(VDD_SOC_IN_3) IC8.F9(VDD_SOC_IN_4) IC8.G6(VDD_SOC_IN_5) IC8.G9(VDD_SOC_IN_6) IC8.H6(VDD_SOC_IN_7) IC8.H9(VDD_SOC_IN_8) IC8.J5(DCDC_SENSE) IC8.J9(VDD_SOC_IN_9) L5.1
VDD_HIGH_CAP: C101.2 C102.1 IC8.P8(VDD_HIGH_CAP)
VDD_SNVS: C2.2 C69.1 IC8.M9(VDD_SNVS_IN) U1.1(VOUT)
VDD_SNVS_CAP: C70.1 IC8.M10(VDD_SNVS_CAP)
VDD_USB_CAP: C71.1 C72.2 C73.2 IC8.K8(VDD_USB_CAP)
VDDA: C51.1 C52.2 J4.4 L4.1
VDDA_ADC_3P3: C59.1 C60.2 C61.2 IC8.N14(VDDA_ADC_3P3) L6.1
VIN [power]: D7.1 J6.2 Q6.3(D)
VIN_INT [power]: C5.2 IC1.6(VIN2) Q6.2(S)
VIN_LDO: C74.1 C91.2 L9.2 U3.31(VIN_LDO)
WAKEUP: IC8.L6(WAKEUP) Q2.2(S)
WIFI_CLK [wifi]: IC8.M13(GPIO_AD_B1_09) U3.20(SDIO_CLK)
WIFI_CMD [wifi]: IC8.H13(GPIO_AD_B1_08) RN2.16 U3.22(SDIO_CMD)
WIFI_D0 [wifi]: IC8.L12(GPIO_AD_B1_04) RN2.14 U3.24(SDIO_DATA_0)
WIFI_D1 [wifi]: IC8.K12(GPIO_AD_B1_05) RN2.12 U3.26(SDIO_DATA_1)
WIFI_D2 [wifi]: IC8.J12(GPIO_AD_B1_06) RN2.15 U3.23(SDIO_DATA_2)
WIFI_D3 [wifi]: IC8.K10(GPIO_AD_B1_07) RN2.13 U3.25(SDIO_DATA_3)
WL_H_WAKE: IC8.E11(GPIO_B0_15) U3.27(WL_GPIO_0_HOST_WAKE)
WL_REG_ON: IC8.E10(GPIO_B0_14) U3.28(WL_REG_ON)
XTALI: C106.1 IC8.P11(XTALI) R40.1 Y2.3(CRYSTAL_2)
XTALO: C105.1 IC8.N11(XTALO) Y2.1(CRYSTAL_1)
Unconnected: ANT1.2(NC) FL1.9 FL1.10 FL1.11 FL1.12 H1.B2,8(MOUNT) H2.B2,8(MOUNT) IC3.E2(NC) IC4.1(NC_1) IC4.2(NC_2) IC4.3(NC_3) IC4.7(NC_4) IC7.2(NC) IC8.N7(USB_OTG2_DN) IC8.N10(GPANAIO) IC8.N12(USB_OTG1_CHD_B) IC8.N13(CCM_CLK1_P) IC8.P6(USB_OTG2_VBUS) IC8.P7(USB_OTG2_DP) IC8.P13(CCM_CLK1_N) IC9.7(XO) IC9.16(REF_CLK) J1.A8(SBU1) J1.B8(SBU2) J4.1 J4.3 J4.6 J4.7 J4.8 J4.9 J8.7 RN1.15 RN1.16 RN2.9 RN2.10 RN2.11 U3.5(!BT_UART_RTS_N) U3.6(BT_GPIO_3) U3.7(BT_GPIO_4) U3.8(BT_PCM_SYNC) U3.9(BT_PCM_IN) U3.10(BT_PCM_OUT) U3.11(BT_PCM_CLK) U3.13(BT_GPIO_5) U3.15(WL_GPIO_4) U3.16(BT_I2S_DO) U3.17(WL_GPIO_2) U3.18(WL_GPIO_1)

## Notes on the sheet
- USB Connector | Battery Charging | Ideal Diode | SNVS Reg | Main Regulator
- * Red LED = Charging
- * Green LED = USB Power
- * Blue LED = VIN Power | * PMIC_REG_ON is level shifted to ensure regulator goes into PFM mode
- * CKE is pulled down by 100K on the RT1062
- 16-BIT SDRAM | Program QSPI Flash | Storage QSPI Flash | Security | Accelerometer | RGB LED | Mechanical
- MIMXRT1062 | SD CARD | IMAGE SENSOR CONNECTOR | I/O HEADERS
- * 8KV ESD Protection on MDI
  pins and the LED pin
- Ethernet | WiFi/Bluetooth
- * JTAG_MOD is used for BT_REG_ON - the pin is sampled on the
  rising edge of reset and is pulled low by 10K
- JTAG
- * The JTAG Interface is designed to connect to the SEGGER 9-Pin Cortex-M Adapter
- Copyright (c) 2013-2023 OpenMV <openmv@openmv.io>
- This work is licensed under the Creative Commons Attribution-ShareAlike 3.0 License.
- To view a copy of this license, visit http://creativecommons.org/licenses/by-sa/3.0/

## Library data of the parts
ANT1 = AMCA31-2R450G-S1F-T3:AMCA31-2R450G-S1F-T3: ABRACON - AMCA31-2R450G-S1F-T3 - ANTENNA, CHIP, 2.45GHZ, 50 OHM, 1206 Source: Datasheet <https://abracon.com/chip-antenna/AMCA31-2R450G-S1F-T.pdf>; DESCRIPTION: ABRACON - AMCA31-2R450G-S1F-T3 - ANTENNA, CHIP, 2.45GHZ, 50 OHM, 1206; HEIGHT: 1.4mm; MANUFACTURER_NAME: ABRACON; MANUFACTURER_PART_NUMBER: AMCA31-2R450G-S1F-T3; MOUSER_PART_NUMBER: 815-CA312R450GS1FT3; MOUSER_PRICE-STOCK: https://www.mouser.co.uk/ProductDetail/ABRACON/AMCA31-2R450G-S1F-T3?qs=AAveGqk956GLuOddQEK40Q%3D%3D; MPN: AMCA31-2R450G-S1F-T3
C1-C5 C8-C10 C12 C17 C21 C23 C25 C27 C30 C33 C35 C39-C42 C44 C46 C52 C57 C60 C64 C65 C67 C72 C81 C83 C90-C93 C95 C101 C104 C108 = sfe:CAP: Capacitor Standard 0603 ceramic capacitor, and 0.1" leaded capacitor.; MPN: JMK105BBJ475MV-F
C6 C7 C14 C18 C29 C32 C37 C49 C51 C58 C61 C73 C85 C96 = SparkFun-Capacitors:22UF: 22µF ceramic capacitors A capacitor is a passive two-terminal electrical component used to store electrical energy temporarily in an electric field.; MPN: CL21A226MQQNNNE; PROD_ID: CAP-08402
C11 C13 C15 C16 C19 C20 C22 C24 C26 C28 C31 C34 C36 C38 C43 C45 C47 C48 C50 C53-C56 C59 C62 C63 C66 C68-C71 C74-C76 C82 C84 C86-C89 C94 C97-C100 C102 C103 C107 C109 = rcl:C-EU: CAPACITOR, European symbol; MPN: GRM033R60J224ME15D; SPICEPREFIX: C
C77 = GRM0335C1H1R5BA01D:GRM0335C1H1R5BA01D: Chip Capacitor value 1R5 Source: Datasheet <http://www.murata.com/~/media/webrenewal/support/library/catalog/products/capacitor/mlcc/c02e.pdf>; DESCRIPTION: Chip Capacitor value 1R5; HEIGHT: 0.33mm; MANUFACTURER_NAME: Murata Electronics; MANUFACTURER_PART_NUMBER: GRM0335C1H1R5BA01D; MOUSER_PART_NUMBER: 81-GRM0335C1H1R5BA1D; MOUSER_PRICE-STOCK: https://www.mouser.co.uk/ProductDetail/Murata-Electronics/GRM0335C1H1R5BA01D?qs=7vGxPDjevFPFqveGwv%252BPUQ%3D%3D; MPN: GRM0335C1H1R5BA01D
C78 = GRM0335C1H1R5BA01D:GRM0335C1H1R5BA01D: Chip Capacitor value 1R5 Source: Datasheet <http://www.murata.com/~/media/webrenewal/support/library/catalog/products/capacitor/mlcc/c02e.pdf>; DESCRIPTION: Chip Capacitor value 1R5; HEIGHT: 0.33mm; MANUFACTURER_NAME: Murata Electronics; MANUFACTURER_PART_NUMBER: GRM0335C1H1R5BA01D; MOUSER_PART_NUMBER: 81-GRM0335C1H1R5BA1D; MOUSER_PRICE-STOCK: https://www.mouser.co.uk/ProductDetail/Murata-Electronics/GRM0335C1H1R5BA01D?qs=7vGxPDjevFPFqveGwv%252BPUQ%3D%3D; MPN: GRM0335C1H1R5BA01D; POPULATE: 0
C79 C80 = rcl:C-EU: CAPACITOR, European symbol; MPN: GRM0335C1E180JA01D; SPICEPREFIX: C
C105 C106 = rcl:C-EU: CAPACITOR, European symbol; MPN: GRM0335C1E4R7CA01D; SPICEPREFIX: C
C110 = sfe:CAP: Capacitor Standard 0603 ceramic capacitor, and 0.1" leaded capacitor.; MPN: VJ0402Y102JXACW1BC
CN1 = adafruit-updated:JST_2PIN: JST 2-Pin Connectors of various flavors SMT-RA (S2B-PH-SM4) 4UConnector #17311 SMT (B2B-PH-SM4) THM-RA (S2B-PH) THM (B2B-PH); MPN: S2B-PH-K-S(LF)(SN)
D1 D3 = UHD1110-FKA-CL1A13R3Q1BBQFMF3:UHD1110-FKA-CL1A13R3Q1BBQFMF3: LED RGB SMD, SIZE 1 X 1 mm Check availability <https://pricing.snapeda.com/parts/UHD1110-FKA-CL1A13R3Q1BBQFMF3/Cree%20Inc./view-part?ref=eda>; AVAILABILITY: In Stock; DESCRIPTION: Red, Green, Blue (RGB) - LED Indication - Discrete 1.9V Red, 2.9V Green, 2.9V Blue 0404 (1010 Metric); MF: Cree Inc.; MP: UHD1110-FKA-CL1A13R3Q1BBQFMF3; MPN: UHD1110-FKA-CL1A13r3q1BBQFMF3; PACKAGE: 0404 Cree Inc.; PRICE: None; PURCHASE-URL: https://pricing.snapeda.com/search/part/UHD1110-FKA-CL1A13R3Q1BBQFMF3/?ref=eda
D2 D4-D10 = CPDQT5V0HE-HF:CPDQT5V0HE-HF: ESD Suppressors / TVS Diodes DIODE ESD 5VWM 65W 0402/SOD-923F Source: Datasheet <https://www.comchiptech.com/admin/files/product/CPDQT5V0HE-HF RevA.PDF>; DESCRIPTION: ESD Suppressors / TVS Diodes DIODE ESD 5VWM 65W 0402/SOD-923F; HEIGHT: 0.42mm; MANUFACTURER_NAME: Comchip Technology; MANUFACTURER_PART_NUMBER: CPDQT5V0HE-HF; MPN: CPDQT5V0HE-HF
FD1-FD8 = SparkFun-Aesthetics:FIDUCIAL: Fiducial Alignment Points Point-of-reference for pick-and-place machines and other optical instruments.
FL1 = ECMF02-4CMX8:ECMF02-4CMX8: Common Mode Filter & ESD Prot. USB uQFN8 STMicroelectronics ECMF02 Series, Signal Filter uQFN SMD, Flat Contact Termination, 2.6 x 1.3 x 0.6mm Source: Datasheet <http://www.st.com/content/ccc/resource/technical/document/datasheet/group3/1c/93/cf/72/85/cf/4d/d6/DM00039389/files/DM00039389.pdf/jcr:content/translations/en.DM00039389.pdf>; DESCRIPTION: Common Mode Filter & ESD Prot. USB uQFN8 STMicroelectronics ECMF02 Series, Signal Filter uQFN SMD, Flat Contact Termination, 2.6 x 1.3 x 0.6mm; HEIGHT: mm; MANUFACTURER_NAME: STMicroelectronics; MANUFACTURER_PART_NUMBER: ECMF02-4CMX8; MOUSER_PART_NUMBER: 511-ECMF02-4CMX8; MOUSER_PRICE-STOCK: https://www.mouser.co.uk/ProductDetail/STMicroelectronics/ECMF02-4CMX8?qs=xYt8xtm2zhmK7GoDlDZR3A%3D%3D; MPN: ECMF02-4CMX8
FL2-FL5 = EMIF06-1005M12:EMIF06-1005M12: EMI Filter Circuits 6lin lw cpcitnc EMI 45pF -35db @ 900MHz Source: Datasheet <https://www.st.com/resource/en/datasheet/emif06-1005m12.pdf>; DESCRIPTION: EMI Filter Circuits 6lin lw cpcitnc EMI 45pF -35db @ 900MHz; HEIGHT: 0.65mm; MANUFACTURER_NAME: STMicroelectronics; MANUFACTURER_PART_NUMBER: EMIF06-1005M12; MOUSER_PART_NUMBER: 511-EMIF06-1005M12; MOUSER_PRICE-STOCK: https://www.mouser.co.uk/ProductDetail/STMicroelectronics/EMIF06-1005M12?qs=VJaATVMq%252BXo0u09ZqtQg3A%3D%3D; MPN: EMIF06-1005M12
H1 H2 = holes:MOUNT-PAD-ROUND: MOUNTING PAD, round; POPULATE: 0
IC1 = LM66200DRLR:LM66200DRLR: 1.6-V to 5.5-V, 40-m, 2.5-A, low-IQ, dual ideal diode Source: Datasheet <https://www.ti.com/lit/gpn/lm66200>; DESCRIPTION: 1.6-V to 5.5-V, 40-m, 2.5-A, low-IQ, dual ideal diode; HEIGHT: 0.6mm; MANUFACTURER_NAME: Texas Instruments; MANUFACTURER_PART_NUMBER: LM66200DRLR; MOUSER_PART_NUMBER: 595-LM66200DRLR; MOUSER_PRICE-STOCK: https://www.mouser.co.uk/ProductDetail/Texas-Instruments/LM66200DRLR?qs=Rp5uXu7WBW90hnpZAkIOdQ%3D%3D; MPN: LM66200DRLR
IC2 = AP61300Z6-7:AP61300Z6-7: DCDC Conv LV Buck SOT563 T&R 3K Source: Datasheet <https://componentsearchengine.com/Datasheets/2/AP61300Z6-7.pdf>; DESCRIPTION: DCDC Conv LV Buck SOT563 T&R 3K; HEIGHT: 0.6mm; MANUFACTURER_NAME: Diodes Inc.; MANUFACTURER_PART_NUMBER: AP61300Z6-7; MOUSER_PART_NUMBER: 621-AP61300Z6-7; MOUSER_PRICE-STOCK: https://www.mouser.co.uk/ProductDetail/Diodes-Incorporated/AP61300Z6-7?qs=HBWAp0VN4Ri0dzb0XP2pEA%3D%3D; MPN: AP61300Z6-7
IC3 = IS42S16160G-6BL:IS42S16160G-6BL: DRAM 256M 16Mx16 166Mhz SDR SDRAM, 3.3V Source: Datasheet <http://www.issi.com/WW/pdf/42-45S83200G-16160G.pdf>; DESCRIPTION: DRAM 256M 16Mx16 166Mhz SDR SDRAM, 3.3V; HEIGHT: 1.2mm; MANUFACTURER_NAME: Integrated Silicon Solution Inc.; MANUFACTURER_PART_NUMBER: IS42S16160G-6BL; MOUSER_PART_NUMBER: 870-IS42S16160G-6BL; MOUSER_PRICE-STOCK: https://www.mouser.co.uk/ProductDetail/ISSI/IS42S16160G-6BL?qs=9hm%252BDT1Jr7yvZBhvmJyecQ%3D%3D; MPN: IS42S16160G-6BL
IC4 = ATECC608B-MAHDA-T:ATECC608B-MAHDA-T: CryptoAuthentication 8-Pin UDFN EP T/R Source: Datasheet <http://ww1.microchip.com/downloads/en/DeviceDoc/ATECC608B-CryptoAuthentication-Device-Summary-Data-Sheet-DS40002239A.pdf>; DESCRIPTION: CryptoAuthentication 8-Pin UDFN EP T/R; HEIGHT: 0.6mm; MANUFACTURER_NAME: Microchip; MANUFACTURER_PART_NUMBER: ATECC608B-MAHDA-T; MOUSER_PART_NUMBER: 579-TECC608B-MAHDA-T; MOUSER_PRICE-STOCK: https://www.mouser.co.uk/ProductDetail/Microchip-Technology/ATECC608B-MAHDA-T?qs=W%2FMpXkg%252BdQ71cGyt0Wo3Jw%3D%3D; MPN: ATECC608B-MAHDA-T
IC5 = IS25LP128F-JKLE-TR:IS25LP064D-JKLE-TR: NOR Flash 64M 2.3-3.6V 166Mhz Serial NOR Flash Source: Datasheet <http://www.issi.com/WW/pdf/25LP-WP064D.pdf>; DESCRIPTION: NOR Flash 64M 2.3-3.6V 166Mhz Serial NOR Flash; HEIGHT: 0.8mm; MANUFACTURER_NAME: Integrated Silicon Solution Inc.; MANUFACTURER_PART_NUMBER: IS25LP064D-JKLE-TR; MOUSER_PART_NUMBER: 870-5LP064D-JKLE-TR; MOUSER_PRICE-STOCK: https://www.mouser.com/ProductDetail/ISSI/IS25LP064D-JKLE-TR?qs=xZ%2FP%252Ba9zWqa2pmLA1ByOew%3D%3D; MPN: IS25LP064D-JKLE-TR
IC6 = IS25LP128F-JKLE-TR:IS25LP128F-JKLE-TR: NOR Flash 128M 2.3-3.6V 166Mhz Serial NOR Flash Source: Datasheet <http://www.issi.com/WW/pdf/25LP-WP128F.pdf>; DESCRIPTION: NOR Flash 128M 2.3-3.6V 166Mhz Serial NOR Flash; HEIGHT: 0.8mm; MANUFACTURER_NAME: Integrated Silicon Solution Inc.; MANUFACTURER_PART_NUMBER: IS25LP128F-JKLE-TR; MOUSER_PART_NUMBER: 870-IS25LP128FJKLETR; MOUSER_PRICE-STOCK: https://www.mouser.co.uk/ProductDetail/ISSI/IS25LP128F-JKLE-TR?qs=F5EMLAvA7IC8MN2X519UUw%3D%3D; MPN: IS25LP128F-JKLE-TR
IC7 = MXC4005XC:MXC4005XC: Accelerometers Monolithic and Wafer Level Packaged Three-Axis Accelerometer Source: Datasheet <https://datasheet.datasheetarchive.com/originals/distributors/Datasheets_SAMA/aa0fcdfc55209a6ab2215b00180fe2f1.pdf>; DESCRIPTION: Accelerometers Monolithic and Wafer Level Packaged Three-Axis Accelerometer; HEIGHT: 0.885mm; MANUFACTURER_NAME: MEMSIC; MANUFACTURER_PART_NUMBER: MXC4005XC; MOUSER_PART_NUMBER: 438-MXC4005XC; MOUSER_PRICE-STOCK: https://www.mouser.co.uk/ProductDetail/MEMSIC/MXC4005XC?qs=RcG8xmE7yp3iyYgWLmAtUw%3D%3D; MPN: MXC4005XC
IC8 = MIMXRT1052DVL6B:MIMXRT1052DVL6B: Processors - Application Specialized MIMXRT1052DVL6B/LFBGA196///STANDARD MARKING * TRAY Source: Datasheet <http://www.nxp.com/docs/en/data-sheet/IMXRT1050CEC.pdf>; DESCRIPTION: Processors - Application Specialized MIMXRT106FCVL5B/LFBGA196///STANDARD MARKING * TRAY; HEIGHT: 1.43mm; MANUFACTURER_NAME: NXP; MANUFACTURER_PART_NUMBER: MIMXRT106FCVL5B; MOUSER_PART_NUMBER: 771-MIMXRT106FCVL5B; MOUSER_PRICE-STOCK: https://www.mouser.co.uk/ProductDetail/NXP-Semiconductors/MIMXRT106FCVL5B; MPN: MIMXRT106FCVL5B
IC9 = KSZ8081RNDCA-TR:KSZ8081RNDCA-TR: Ethernet ICs 10/100 BASE-TX Physical Layer Transceiver Source: Datasheet <https://datasheet.datasheetarchive.com/originals/dk/DKDS-15/281122.pdf>; DESCRIPTION: Ethernet ICs 10/100 BASE-TX Physical Layer Transceiver; HEIGHT: 0.9mm; MANUFACTURER_NAME: Microchip; MANUFACTURER_PART_NUMBER: KSZ8081RNDCA-TR; MOUSER_PART_NUMBER: 998-KSZ8081RNDCATR; MOUSER_PRICE-STOCK: https://www.mouser.co.uk/ProductDetail/Microchip-Technology-Atmel/KSZ8081RNDCA-TR?qs=U6T8BxXiZAXLXXdn%2FieQKw%3D%3D; MPN: KSZ8081RNDCA-TR
J1 = USB4105-GF-A:USB4105-GF-A: USB-C (USB TYPE-C) USB 2.0 Receptacle Connector 24 (16+8 Dummy) Position Surface Mount, Right Angle; Through Hole Check availability <https://pricing.snapeda.com/parts/USB4105-GF-A/GCT/view-part?ref=eda>; AVAILABILITY: In Stock; DESCRIPTION: USB-C (USB TYPE-C) USB 2.0 Receptacle Connector 24 (16+8 Dummy) Position Surface Mount, Right Angle; Through Hole; MF: GCT; MP: USB4105-GF-A; MPN: USB4105-GF-A; PACKAGE: None; PRICE: None; PURCHASE-URL: https://pricing.snapeda.com/search/part/USB4105-GF-A/?ref=eda
J2 J3 J6 = SparkFun-Connectors:CONN_08: Multi connection point. Often used as Generic Header-pin footprint for 0.1 inch spaced/style header connections On any of the 0.1 inch spaced packages, you can populate with these: Break Away Headers - Straight <https://www.sparkfun.com/products/116> (PRT-00116) Break Away Male Headers - Right Angle <https://www.sparkfun.com/products/553> (PRT-00553) Female Headers <https://www.sparkfun.com/products/115> (PRT-00115) Break Away Headers - Machine Pin <https://www.sparkfun.com/products/117> (PRT-00117) Break Away Female Headers - Swiss Machine Pin <https://www.sparkfun.com/products/743> (PRT-00743) Arduino Stackable Header - 8 Pin <https://www.sparkfun.com/products/9279> (PRT-09279) For SCREWTERMINALS and SPRING TERMINALS visit here: Screw Terimnals on SparkFun.com <https://www.sparkfun.com/search/results?term=Screw+Terminals> (5mm/3.5mm/2.54mm spacing) This device is also useful as a general connection point to wire up your design to another part of your project. Our various solder wires solder well into these plated through hole pads. Hook-Up Wire - Assortment (Stranded, 22 AWG) <https://www.sparkfun.com/products/11375> (PRT-11375) Hook-Up Wire - Assortment (Solid Core, 22 AWG) <https://www.sparkfun.com/products/11367> (PRT-11367) View the entire wire category on our website here <https://www.sparkfun.com/categories/141> Special notes: Molex polarized connector foot print use with SKU : PRT-08231 with associated crimp pins and housings. 1MM SMD Version SKU: PRT-10208 NOTES ON THE VARIANTS LOCK and LOCK_LONGPADS... This footprint was designed to help hold the alignment of a through-hole component (i.e. 6-pin header) while soldering it into place. You may notice that each hole has been shifted either up or down by 0.005 of an inch from it's more standard position (which is a perfectly straight line). This slight alteration caused the pins (the squares in the middle) to touch the edges of the holes. Because they are alternating, it causes a "brace" to hold the component in place. 0.005 has proven to be the perfect amount of "off-center" position when using our standard breakaway headers. Although looks a little odd when you look at the bare footprint, once you have a header in there, the alteration is very hard to notice. Also,if you push a header all the way into place, it is covered up entirely on the bottom side.; POPULATE: 0; PROD_ID: CONN-08438
J4 = DF12-36-DS:DF12-36-DS; MPN: DF12NB-36DS-0.5V(51)
J5 = 1040310811:USD-1040310811; MPN: 104031-0811
J7 = 2337019-1:2337019-1: RF Connectors / Coaxial Connectors MicroCoax receptacle UMCC Gen 1 Source: Datasheet <https://www.te.com/commerce/DocumentDelivery/DDEController?Action=showdoc&DocId=Customer DrawingC-2337019A3pdfEnglishENG_CD_C-2337019_A3.pdf2337019-1>; DESCRIPTION: RF Connectors / Coaxial Connectors MicroCoax receptacle UMCC Gen 1; HEIGHT: 1.4mm; MANUFACTURER_NAME: TE Connectivity; MANUFACTURER_PART_NUMBER: 2337019-1; MOUSER_PART_NUMBER: 571-2337019-1; MOUSER_PRICE-STOCK: https://www.mouser.co.uk/ProductDetail/TE-Connectivity/2337019-1?qs=l4Gc20tDgJIuN7nS9rJkJw%3D%3D; MPN: 2337019-1; POPULATE: 0
J8 = 3221-10-0300-00:3221-10-0300-00: Check availability <https://pricing.snapeda.com/parts/3221-10-0300-00/CNC%20Tech/view-part?ref=eda>; AVAILABILITY: In Stock; DESCRIPTION: Connector Header Surface Mount 10 position 0.050 (1.27mm); MF: CNC Tech; MP: 3221-10-0300-00; MPN: 3221-10-0300-00; PACKAGE: None; PRICE: None; PURCHASE-URL: https://pricing.snapeda.com/search/part/3221-10-0300-00/?ref=eda
L1 = SparkFun-Coils:INDUCTOR: Inductors; MPN: MFBM1V1608-101-R; PROD_ID: NDUC-07874; VALUE: 33nH/±5%/500mA
L2 = MAKK2016T1R0M:MAKK2016T1R0M: Ind Power Wirewound 1uH 20% 2MHz Metal 2200mA 0806 Check availability <https://pricing.snapeda.com/parts/MAKK2016T1R0M/Taiyo%20Yuden/view-part?ref=eda>; AVAILABILITY: In Stock; DESCRIPTION: 1 µH Shielded Drum Core, Wirewound Inductor 2.2 A 75mOhm Max 0806 (2016 Metric); MF: Taiyo Yuden; MP: MAKK2016T1R0M; MPN: MAKK2016T1R0M; PACKAGE: 2016 Taiyo Yuden; PRICE: None; PURCHASE-URL: https://pricing.snapeda.com/search/part/MAKK2016T1R0M/?ref=eda
L4 L6 L8 = sfe:INDUCTOR: Inductors; MPN: MFBM1V1005-101-R
L5 = MAKK2016T4R7M:MAKK2016T4R7M: INDUCTOR, METAL CORE, SHIELDED, SMD HIGH CURRENT, 4.7uH, 20%, TR Check availability <https://pricing.snapeda.com/parts/MAKK2016T4R7M/Taiyo%20Yuden/view-part?ref=eda>; AVAILABILITY: In Stock; DESCRIPTION: 4.7 µH Shielded Drum Core, Wirewound Inductor 1 A 380mOhm Max 0806 (2016 Metric); MF: Taiyo Yuden; MP: MAKK2016T4R7M; MPN: MAKK2016T4R7M; PACKAGE: 2016 Taiyo Yuden; PRICE: None; PURCHASE-URL: https://pricing.snapeda.com/search/part/MAKK2016T4R7M/?ref=eda
L7 = SparkFun-Coils:INDUCTOR: Inductors; MPN: L-07C3N9SV6T; PROD_ID: NDUC-13457
L9 = MAKK2016T2R2M:MAKK2016T2R2M: INDUCTOR, METAL CORE Check availability <https://pricing.snapeda.com/parts/MAKK2016T2R2M/Taiyo%20Yuden/view-part?ref=eda>; AVAILABILITY: In Stock; DESCRIPTION: 2.2 µH Shielded Drum Core, Wirewound Inductor 1.5 A 160mOhm Max 0806 (2016 Metric); MF: Taiyo Yuden; MP: MAKK2016T2R2M; MPN: MAKK2016T2R2M; PACKAGE: 2016 Taiyo Yuden; PRICE: None; PURCHASE-URL: https://pricing.snapeda.com/search/part/MAKK2016T2R2M/?ref=eda
M1 M2 = 9774030151R:9774030151R; MPN: 9774030151R
Q1-Q5 = 2N7002KW_R1_00001:2N7002KW_R1_00001: MOSFET 60V N-Channel Enhancement Mode MOSFET - ESD Protected Source: Datasheet <https://www.panjit.com.tw/upload/datasheet/2N7002KW.pdf>; DESCRIPTION: MOSFET 60V N-Channel Enhancement Mode MOSFET - ESD Protected; HEIGHT: 1.1mm; MANUFACTURER_NAME: PANJIT; MANUFACTURER_PART_NUMBER: 2N7002KW_R1_00001; MOUSER_PART_NUMBER: 241-2N7002KWR100001; MOUSER_PRICE-STOCK: https://www.mouser.co.uk/ProductDetail/Panjit/2N7002KW_R1_00001?qs=sPbYRqrBIVliWKATqv7jNA%3D%3D; MPN: 2N7002KW_R1_00001
Q6 = PMXB120EPEZ:PMXB120EPEZ: MOSFET 30 V, P-channel Trench MOSFET Source: Datasheet <https://componentsearchengine.com/Datasheets/1/PMXB120EPEZ.pdf>; DESCRIPTION: MOSFET 30 V, P-channel Trench MOSFET; HEIGHT: 0.4mm; MANUFACTURER_NAME: Nexperia; MANUFACTURER_PART_NUMBER: PMXB120EPEZ; MOUSER_PART_NUMBER: 771-PMXB120EPEZ; MOUSER_PRICE-STOCK: https://www.mouser.co.uk/ProductDetail/Nexperia/PMXB120EPEZ?qs=gNSudQoqUYCYLaOobF3dPA%3D%3D; MPN: PMXB120EPEZ
R1 R4 R5 R26 R36 R39 = sfe:RESISTOR: Resistor Basic schematic elements and footprints for 0603, 1206, and PTH resistors.; MPN: CRCW04021K00FKEDC
R2 = sfe:RESISTOR: Resistor Basic schematic elements and footprints for 0603, 1206, and PTH resistors.; MPN: CRCW0402200KFKEDC
R3 R13 R14 R18 R22-R25 R27-R29 R34 = sfe:RESISTOR: Resistor Basic schematic elements and footprints for 0603, 1206, and PTH resistors.; MPN: AC0402FR-07100KL
R6 R7 = sfe:RESISTOR: Resistor Basic schematic elements and footprints for 0603, 1206, and PTH resistors.; MPN: RC0402JR-075K1L
R8 = sfe:RESISTOR: Resistor Basic schematic elements and footprints for 0603, 1206, and PTH resistors.; MPN: AC0402FR-0744K2L
R9 R33 R37 = sfe:RESISTOR: Resistor Basic schematic elements and footprints for 0603, 1206, and PTH resistors.; MPN: AC0402FR-1310KL
R10 = sfe:RESISTOR: Resistor Basic schematic elements and footprints for 0603, 1206, and PTH resistors.; MPN: CRCW04023K30FKEDC
R11 = sfe:RESISTOR: Resistor Basic schematic elements and footprints for 0603, 1206, and PTH resistors.; MPN: WR04X4642FTL
R12 = sfe:RESISTOR: Resistor Basic schematic elements and footprints for 0603, 1206, and PTH resistors.; MPN: RC0402JR-078K2L
R15-R17 = sfe:RESISTOR: Resistor Basic schematic elements and footprints for 0603, 1206, and PTH resistors.; MPN: AC0402JR-072K7L
R19-R21 R35 = sfe:RESISTOR: Resistor Basic schematic elements and footprints for 0603, 1206, and PTH resistors.; MPN: CRGCQ0402F220R
R30 R31 = sfe:RESISTOR: Resistor Basic schematic elements and footprints for 0603, 1206, and PTH resistors.; MPN: AC0402FR-074K7L
R32 = sfe:RESISTOR: Resistor Basic schematic elements and footprints for 0603, 1206, and PTH resistors.; MPN: 0402WGF3002TCE
R38 = sfe:RESISTOR: Resistor Basic schematic elements and footprints for 0603, 1206, and PTH resistors.; MPN: CR0402-FX-6491GLF
R40 = sfe:RESISTOR: Resistor Basic schematic elements and footprints for 0603, 1206, and PTH resistors.; MPN: RC0402FR-072M2L
R41 = sfe:RESISTOR: Resistor Basic schematic elements and footprints for 0603, 1206, and PTH resistors.; MPN: CRCW04021M00FKEDC
RN1 RN2 = EXB-2HV104JV:EXB-2HV104JV: Resistor Networks & Arrays Resistor Array Chip 8 Elements 1506 Source: Datasheet <https://componentsearchengine.com/Datasheets/1/EXB-2HV104JV.pdf>; DESCRIPTION: Resistor Networks & Arrays Resistor Array Chip 8 Elements 1506; HEIGHT: 0.55mm; MANUFACTURER_NAME: Panasonic; MANUFACTURER_PART_NUMBER: EXB-2HV104JV; MOUSER_PART_NUMBER: 667-EXB-2HV104JV; MOUSER_PRICE-STOCK: https://www.mouser.co.uk/ProductDetail/Panasonic/EXB-2HV104JV?qs=9MgLB97nXf9MD%252BafCCtPcA%3D%3D
U1 = MIC5365-3.3YMT-TZ:MIC5365-3.3YMT-TZ; MPN: MIC5365-3.3YMT-TZ
U2 = BQ24075RGTR:BQ24075RGTR: Standalone 1-cell 1.5-A linear charger, Power Path, 4.2-V VBAT and 5.5-V VOUT 16-VQFN -40 to 85 Check availability <https://pricing.snapeda.com/parts/BQ24075RGTR/Texas%20Instruments/view-part?ref=eda>; AVAILABILITY: In Stock; DESCRIPTION: Standalone 1-cell 1.5-A linear battery charger, Power Path, 4.2-V VBAT and 5.5-V VOUT; MF: Texas Instruments; MP: BQ24075RGTR; MPN: BQ24075RGTR; PACKAGE: VQFN-16 Texas Instruments; PRICE: None; PURCHASE-URL: https://pricing.snapeda.com/search/part/BQ24075RGTR/?ref=eda
U3 = LBEE5KL1DX-TEMP:LBEE5KL1DX-TEMP: Broadcom Chipset for 802.11b/g/n + Bluetooth 4.1/EDR; AVAILABILITY: Unavailable; DESCRIPTION: WICED Transceiver; 802.11 b/g/n _Wi-Fi, WiFi, WLAN_, Bluetooth® Smart Ready 4.x Dual Mode For Use With BCM4343W, i.MX 6; MF: Murata Electronics; MP: LBEE5KL1DX-TEMP; MPN: LBEE5KL1DX-883; PACKAGE: None; PRICE: None
Y1 = ABS07-32.768KHZ-7-T:ABS07-32.768KHZ-7-T: Check availability <https://pricing.snapeda.com/parts/ABS07-32.768KHZ-7-T/Abracon/view-part?ref=eda>; AVAILABILITY: In Stock; DESCRIPTION: 32.768 kHz ±20ppm Crystal 7pF 70 kOhms 2-SMD, No Lead; MF: Abracon; MP: ABS07-32.768KHZ-7-T; MPN: SC32S-7PF20PPM; PACKAGE: SMD-2 Abracon LLC; PRICE: None; PURCHASE-URL: https://pricing.snapeda.com/search/part/ABS07-32.768KHZ-7-T/?ref=eda
Y2 = XRCGB24M000F3M00R0:XRCGB24M000F3M00R0: Murata 24MHz Crystal +/-30ppm SMD 4-Pin 2 x 1.6 x 0.7mm Source: Datasheet <https://componentsearchengine.com/Datasheets/1/XRCGB24M000F3M00R0.pdf>; DESCRIPTION: Murata 24MHz Crystal +/-30ppm SMD 4-Pin 2 x 1.6 x 0.7mm; HEIGHT: mm; MANUFACTURER_NAME: Murata Electronics; MANUFACTURER_PART_NUMBER: XRCGB24M000F3M00R0; MOUSER_PART_NUMBER: 81-XRCGB24M000F3M0R0; MOUSER_PRICE-STOCK: https://www.mouser.co.uk/ProductDetail/Murata-Electronics/XRCGB24M000F3M00R0?qs=e%252BE4OD6MgMefDn8VvwDdfw%3D%3D; MPN: XRCGB24M000F3M00R0

## Net classes
0 default: width 0.102 mm, drill 0.127 mm, clearance 0.102 mm
1 power: width 0.254 mm, drill 0.254 mm, clearance 0.102 mm
2 gnd: width 0.102 mm, drill 0.127 mm, clearance 0.102 mm
3 sdram: width 0.102 mm, drill 0.127 mm, clearance 0.102 mm
4 jtag: width 0.102 mm, drill 0.127 mm, clearance 0.102 mm
5 dcmi: width 0.102 mm, drill 0.127 mm, clearance 0.102 mm
6 spi: width 0.102 mm, drill 0.127 mm, clearance 0.102 mm
7 flash: width 0.102 mm, drill 0.127 mm, clearance 0.102 mm
9 eth: width 0.102 mm, drill 0.127 mm, clearance 0.102 mm
10 mdi: width 0.127 mm, drill 0.127 mm, clearance 0.102 mm
11 wifi: width 0.102 mm, drill 0.127 mm, clearance 0.102 mm
12 sdcard: width 0.102 mm, drill 0.127 mm, clearance 0.102 mm
13 i2c: width 0.102 mm, drill 0.127 mm, clearance 0.102 mm
14 mdio: width 0.102 mm, drill 0.127 mm, clearance 0.102 mm
15 usb: width 0.102 mm, drill 0.127 mm, clearance 0.102 mm